# Altium project Handheld.PrjPcb (part 1 of 2)
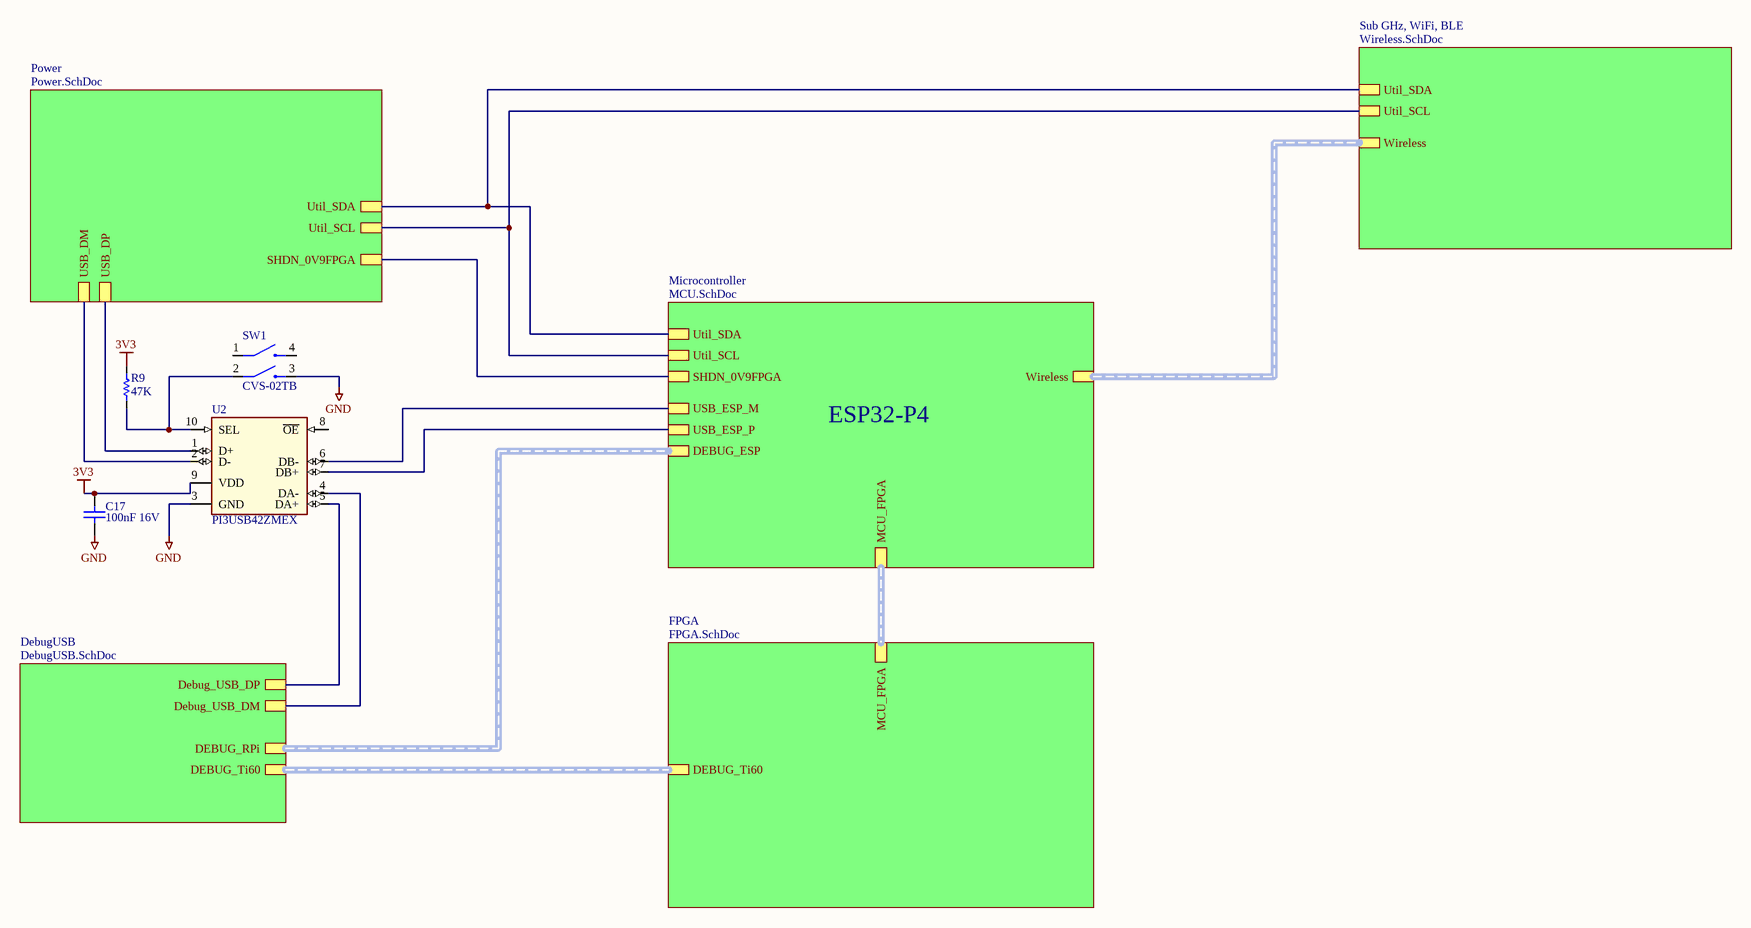
[diagram p0: Main.SchDoc]
CAGE_CODE: ?????; CONTRACT_NUMBER: <CONTRACT NO>; DOC_NO_ASSY_DWG: <ASSY DWG NO>; DOC_NO_BOM: <BOM DOC NO>; DOC_NO_FAB_DWG: <FAB DWG NO>; DOC_NO_SCH_DWG: <SCH DWG NO>; PCB_2_DEC_TOL: +/-.01; PCB_3_DEC_TOL: +/-.010; PCB_ANG_TOL: +/-1/2; PCB_ASSEMBLY_NO: <PCB ASSY NO>; PCB_CHECKER: - -----; PCB_CHECKER_APP_DATE: --/--/----; PCB_DESIGNER: - -----; PCB_DESIGNER_APP_DATE: --/--/----; PCB_DWG_NO: <PCB DWG NO>; PCB_ENGINEER: - -----; PCB_ENGINEER_APP_DATE: --/--/----; PCB_PART_NUMBER: <PCB PN>; PCB_REV: A; SCH_REV: A
10 sheets, 262 parts. Net scope: hierarchical (ports join the sheet entries above them; power ports are global).
Board file: Handheld_REV1.PcbDoc
Sheets:
  Main.SchDoc
    Microcontroller = MCU.SchDoc
      MMI = MMI.SchDoc
    FPGA = FPGA.SchDoc
    Power = Power.SchDoc
    DebugUSB = DebugUSB.SchDoc
    Sub GHz, WiFi, BLE = Wireless.SchDoc
      WiFi = CC3351.SchDoc
      Sub GHz and LoRa = LR2021.SchDoc
      NFC = ST25R.SchDoc

## Sheet Main.SchDoc
size A3; SheetNumber: 1; SheetTotal: 10; ENG_APP_DATE: --/--/--; DSN_APP_DATE: --/--/--; CHK_APP_DATE: --/--/--

### Parts
C17  100nF 16V  [0402]
R9  47K  [0603 Resistor]
SW1  CVS-02TB  [CVS-02TB-Footprint-1]
U2  PI3USB42ZMEX  [QFN40P140X180X60-10N]

### Sub-sheets
DebugUSB = DebugUSB.SchDoc: DEBUG_Ti60 (harness DEBUG_Ti60), DEBUG_RPi (harness DEBUG_RPi), Debug_USB_DM, Debug_USB_DP
FPGA = FPGA.SchDoc: DEBUG_Ti60, MCU_FPGA
Microcontroller = MCU.SchDoc: Util_SDA, Util_SCL, DEBUG_ESP (harness DEBUG_P4), Wireless (harness Wireless), USB_ESP_M, USB_ESP_P, MCU_FPGA (harness MCU_FPGA), SHDN_0V9FPGA
Power = Power.SchDoc: Util_SDA, Util_SCL, USB_DP, USB_DM, SHDN_0V9FPGA
Sub GHz, WiFi, BLE = Wireless.SchDoc: Wireless (harness Wireless), Util_SDA, Util_SCL

### Nets
3V3: C17.2 R9.1 U2.9(VDD)
GND: C17.1 SW1.3 U2.3(GND)
Debug_USB_DM: U2.4(DA-) ; sheet DebugUSB/Debug_USB_DM
Debug_USB_DP: U2.5(DA+) ; sheet DebugUSB/Debug_USB_DP
SHDN_0V9FPGA: sheet Microcontroller/SHDN_0V9FPGA, sheet Power/SHDN_0V9FPGA
USB_DM: U2.2(D-) ; sheet Power/USB_DM
USB_DP: U2.1(D+) ; sheet Power/USB_DP
USB_ESP_M: U2.6(DB-) ; sheet Microcontroller/USB_ESP_M
USB_ESP_P: U2.7(DB+) ; sheet Microcontroller/USB_ESP_P
Util_SCL: sheet Microcontroller/Util_SCL, sheet Power/Util_SCL, sheet Sub GHz, WiFi, BLE/Util_SCL
Util_SDA: sheet Microcontroller/Util_SDA, sheet Power/Util_SDA, sheet Sub GHz, WiFi, BLE/Util_SDA
NetR9_2: R9.2 SW1.2 U2.10(SEL)

Not connected (* = marked no-connect by the designer): SW1 1 4; U2 8(~{OE})

### Buses and harness runs
harness sheet DebugUSB/DEBUG_RPi = sheet Microcontroller/DEBUG_ESP
harness sheet DebugUSB/DEBUG_Ti60 = sheet FPGA/DEBUG_Ti60
harness sheet FPGA/MCU_FPGA = sheet Microcontroller/MCU_FPGA
harness sheet Microcontroller/Wireless = sheet Sub GHz, WiFi, BLE/Wireless

### Notes on the sheet
- ESP32-P4
- Project:
- Title:
- Sheet number:
- Revision:
- Designer:
- out of
- Date:

### Library data of the parts
C17 = CMP-00017-A.2
R9 = CMP-001-B87-6: 47K, 1%, 1/10W, 0603
SW1 = CMP-001-L08-A.1: SWITCH SLIDE DIP SPST 100MA 6V; Pitch: 0.039inch; Electrical Life: 1000Cycles; Body Material: Polyphenylene; Actuator Type: Slide (Standard); Number of Positions: 2; Washable: No; Min Operating Temperature: -40°C; Max Operating Temperature: 85°C; Current Rating: 100mA; Length: 0.118inch; Termination: Gull Wing; Contact Plating: Gold; Voltage Rating (DC): 6V; Mount: Surface Mount; Contact Material: Stainless Steel; Throw Configuration: SPST; Packaging: Tape and Reel
U2 = PI3USB42ZMEX: USB Switch IC 1 Channel 10-UQFN (1.8x1.4); MF: Diodes Inc.; MP: PI3USB42ZMEX; Value: *; Availability: Unavailable; Package: UQFN-10 Diodes Inc.; SnapEDA_Link: https://www.snapeda.com/parts/PI3USB42ZMEX/Diodes%20Inc./view-part/1218281/?ref=snap; Price: None

## Sheet MCU.SchDoc
size A3; SheetNumber: 2; SheetTotal: 10
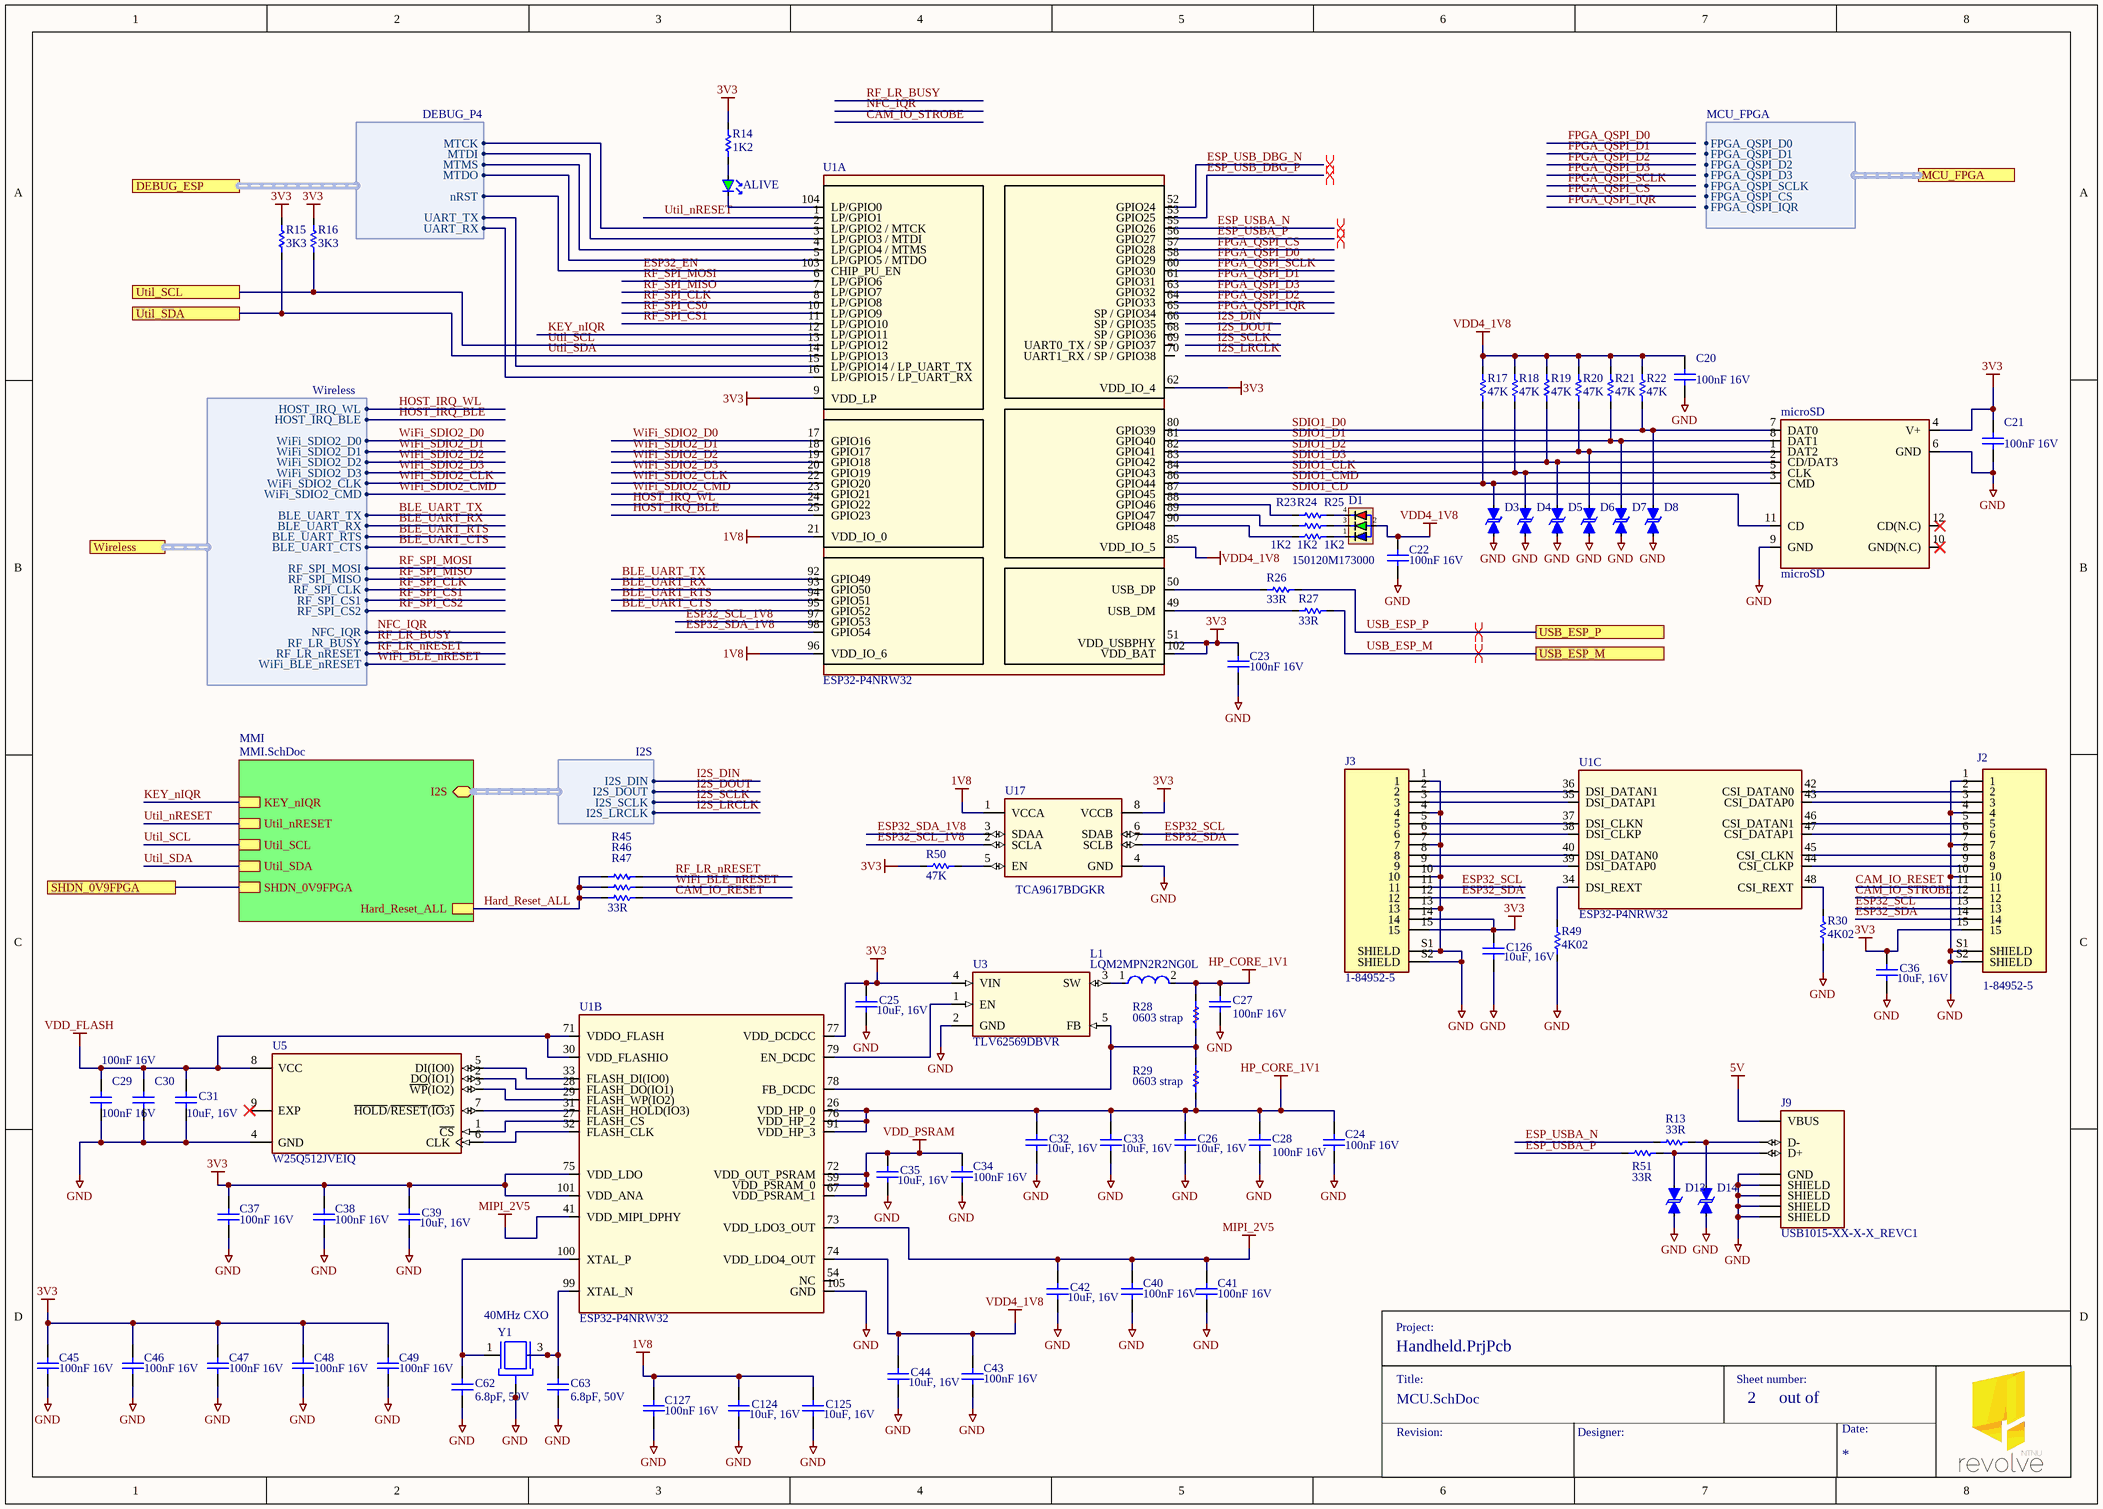
[diagram p1: MCU.SchDoc]

### Parts
ALIVE  SMD LED 0603, Green  [LED-0603-RED]  (value not drawn)
C20  100nF 16V  [0402]
C21  100nF 16V  [0402]
C22  100nF 16V  [0402]
C23  100nF 16V  [0402]
C24  100nF 16V  [0402]
C25  10uF, 16V  [0603 Capacitor]
C26  10uF, 16V  [0603 Capacitor]
C27  100nF 16V  [0402]
C28  100nF 16V  [0402]
C29  100nF 16V  [0402]
C30  100nF 16V  [0402]
C31  10uF, 16V  [0603 Capacitor]
C32  10uF, 16V  [0603 Capacitor]
C33  10uF, 16V  [0603 Capacitor]
C34  100nF 16V  [0402]
C35  10uF, 16V  [0603 Capacitor]
C36  10uF, 16V  [0603 Capacitor]
C37  100nF 16V  [0402]
C38  100nF 16V  [0402]
C39  10uF, 16V  [0603 Capacitor]
C40  100nF 16V  [0402]
C41  100nF 16V  [0402]
C42  10uF, 16V  [0603 Capacitor]
C43  100nF 16V  [0402]
C44  10uF, 16V  [0603 Capacitor]
C45  100nF 16V  [0402]
C46  100nF 16V  [0402]
C47  100nF 16V  [0402]
C48  100nF 16V  [0402]
C49  100nF 16V  [0402]
C62  6.8pF, 50V  [0402 resistor]
C63  6.8pF, 50V  [0402 resistor]
C124  10uF, 16V  [0603 Capacitor]
C125  10uF, 16V  [0603 Capacitor]
C126  10uF, 16V  [0603 Capacitor]
C127  100nF 16V  [0402]
D1  150120M173000  [WL-SFCW_1206]
D3  DESD3V3E1BL-7B  [CR_X1-DFN1006-2_DIO-M]  (value not drawn)
D4  DESD3V3E1BL-7B  [CR_X1-DFN1006-2_DIO-M]  (value not drawn)
D5  DESD3V3E1BL-7B  [CR_X1-DFN1006-2_DIO-M]  (value not drawn)
D6  DESD3V3E1BL-7B  [CR_X1-DFN1006-2_DIO-M]  (value not drawn)
D7  DESD3V3E1BL-7B  [CR_X1-DFN1006-2_DIO-M]  (value not drawn)
D8  DESD3V3E1BL-7B  [CR_X1-DFN1006-2_DIO-M]  (value not drawn)
D13  DESD3V3E1BL-7B  [CR_X1-DFN1006-2_DIO-M]  (value not drawn)
D14  DESD3V3E1BL-7B  [CR_X1-DFN1006-2_DIO-M]  (value not drawn)
J2  1-84952-5  [TE_1-84952-5]
J3  1-84952-5  [TE_1-84952-5]
J9  USB1015-XX-X-X_REVC1  [GCT_USB1015-XX-X-X_REVC1]
L1  LQM2MPN2R2NG0L  [FP-LQM2MPN_G0-IPC_B]
microSD  microSD  [microSD]
R13  33R  [0603 Resistor]
R14  1K2  [0603 Resistor]
R15  3K3  [0603 Resistor]
R16  3K3  [0603 Resistor]
R17  47K  [0603 Resistor]
R18  47K  [0603 Resistor]
R19  47K  [0603 Resistor]
R20  47K  [0603 Resistor]
R21  47K  [0603 Resistor]
R22  47K  [0603 Resistor]
R23  1K2  [0603 Resistor]
R24  1K2  [0603 Resistor]
R25  1K2  [0603 Resistor]
R26  33R  [0603 Resistor]
R27  33R  [0603 Resistor]
R28  0603 strap  [0603 pads]
R29  0603 strap  [0603 pads]
R30  4K02  [0603 Resistor]
R45  33R  [0603 Resistor]  (value not drawn)
R46  33R  [0603 Resistor]  (value not drawn)
R47  33R  [0603 Resistor]
R49  4K02  [0603 Resistor]
R50  47K  [0603 Resistor]
R51  33R  [0603 Resistor]
U1  ESP32-P4NRW32  [QFN35P1000X1000X85_HS-105M]  (parts A,B,C of 3)
U3  TLV62569DBVR  [SOT95P280X145-5N]
U5  W25Q512JVEIQ  [SON127P600X800X80-9N]
U17  TCA9617BDGKR  [SOP65P490X110-8N]
Y1  40MHz CXO  [XTAL_ECS-400-10-37B2-CKM-TR]

### Sub-sheets
MMI = MMI.SchDoc: KEY_nIQR, Util_nRESET, Util_SCL, Util_SDA, SHDN_0V9FPGA, Hard_Reset_ALL, I2S (bidir, harness I2S)

### Ports
DEBUG_ESP (harness DEBUG_P4), MCU_FPGA (harness MCU_FPGA), SHDN_0V9FPGA, USB_ESP_M, USB_ESP_P, Util_SCL, Util_SDA, Wireless (harness Wireless)

### Harnesses
DEBUG_P4: MTCK, MTDI, nRST, UART_TX, UART_RX, MTMS, MTDO
Wireless: WiFi_SDIO2_D0, WiFi_SDIO2_D1, WiFi_SDIO2_D2, WiFi_SDIO2_D3, WiFi_SDIO2_CLK, WiFi_SDIO2_CMD, BLE_UART_TX, BLE_UART_RX, RF_SPI_MOSI, RF_SPI_CLK, RF_SPI_MISO, RF_SPI_CS1, RF_SPI_CS2, BLE_UART_RTS, BLE_UART_CTS, HOST_IRQ_WL, HOST_IRQ_BLE, NFC_IQR, RF_LR_BUSY, RF_LR_nRESET, WiFi_BLE_nRESET
MCU_FPGA: FPGA_QSPI_D0, FPGA_QSPI_D1, FPGA_QSPI_D2, FPGA_QSPI_D3, FPGA_QSPI_SCLK, FPGA_QSPI_CS, FPGA_QSPI_IQR
I2S: I2S_DIN, I2S_DOUT, I2S_SCLK, I2S_LRCLK

### Nets
1V8: C124.2 C125.2 C127.2 U1.21(VDD_IO_0) U1.96(VDD_IO_6) U17.1(VCCA)
3V3: C21.2 C23.2 C25.2 C36.2 C37.2 C38.2 C39.2 C45.2 C46.2 C47.2 C48.2 C49.2 C126.2 J2.15 J3.14 J3.15 microSD.4(V+) R14.2 R15.2 R16.2 R50.1 U1.9(VDD_LP) U1.51(VDD_USBPHY) U1.62(VDD_IO_4) U1.75(VDD_LDO) U1.77(VDD_DCDCC) U1.101(VDD_ANA) U1.102(VDD_BAT) U3.4(VIN) U17.8(VCCB)
5V: J9.1(VBUS)
GND: C20.1 C21.1 C22.1 C23.1 C24.1 C25.1 C26.1 C27.2 C28.2 C29.1 C30.1 C31.1 C32.1 C33.1 C34.1 C35.1 C36.1 C37.1 C38.1 C39.1 C40.1 C41.1 C42.1 C43.1 C44.1 C45.1 C46.1 C47.1 C48.1 C49.1 C62.1 C63.1 C124.1 C125.1 C126.1 C127.1 D3.2(ANODE) D4.2(ANODE) D5.2(ANODE) D6.2(ANODE) D7.2(ANODE) D8.2(ANODE) D13.2(ANODE) D14.2(ANODE) J2.1 J2.4 J2.7 J2.10 J2.S1(SHIELD) J2.S2(SHIELD) J3.1 J3.4 J3.7 J3.10 J3.13 J3.S1(SHIELD) J3.S2(SHIELD) J9.4(GND) J9.SH1(SHIELD) J9.SH2(SHIELD) J9.SH3(SHIELD) J9.SH4(SHIELD) microSD.6(GND) microSD.9(GND) R30.1 R49.1 U1.105(GND) U3.2(GND) U5.4(GND) U17.4(GND) Y1.2(GND) Y1.4(GND)
HP_CORE_1V1: C24.2 C26.2 C27.1 C28.1 C32.2 C33.2 L1.2 R28.2 R29.1 U1.26(VDD_HP_0) U1.76(VDD_HP_2) U1.91(VDD_HP_3)
MIPI_2V5: C40.2 C41.2 C42.2 U1.41(VDD_MIPI_DPHY) U1.73(VDD_LDO3_OUT)
VDD4_1V8: C20.2 C22.2 C43.2 C44.2 D1.2(Anode) R17.1 R18.1 R19.1 R20.1 R21.1 R22.1 U1.74(VDD_LDO4_OUT) U1.85(VDD_IO_5)
VDD_FLASH: C29.2 C30.2 C31.2 U1.30(VDD_FLASHIO) U1.71(VDDO_FLASH) U5.8(VCC)
VDD_PSRAM: C34.2 C35.2 U1.59(VDD_PSRAM_0) U1.67(VDD_PSRAM_1) U1.72(VDD_OUT_PSRAM)
BLE_UART_CTS: U1.95(GPIO52) ; port Wireless.BLE_UART_CTS
BLE_UART_RTS: U1.94(GPIO51) ; port Wireless.BLE_UART_RTS
BLE_UART_RX: U1.93(GPIO50) ; port Wireless.BLE_UART_RX
BLE_UART_TX: U1.92(GPIO49) ; port Wireless.BLE_UART_TX
CAM_IO_RESET: J2.11 R47.2
CAM_IO_STROBE: J2.12
ESP32_EN: U1.103(CHIP_PU_EN) ; port DEBUG_ESP.nRST
ESP32_SCL: J2.13 J3.11 U17.6(SDAB)
ESP32_SCL_1V8: U1.97(GPIO53) U17.2(SCLA)
ESP32_SDA: J2.14 J3.12 U17.7(SCLB)
ESP32_SDA_1V8: U1.98(GPIO54) U17.3(SDAA)
ESP_USB_DBG_N: U1.52(GPIO24)
ESP_USB_DBG_P: U1.53(GPIO25)
ESP_USBA_N: R13.1 U1.55(GPIO26)
ESP_USBA_P: R51.1 U1.56(GPIO27)
FPGA_QSPI_CS: U1.57(GPIO28)
FPGA_QSPI_D0: U1.58(GPIO29)
FPGA_QSPI_D1: U1.61(GPIO31)
FPGA_QSPI_D2: U1.64(GPIO33)
FPGA_QSPI_D3: U1.63(GPIO32)
FPGA_QSPI_IQR: U1.65(SP_/_GPIO34)
FPGA_QSPI_SCLK: U1.60(GPIO30)
Hard_Reset_ALL: R45.1 R46.1 R47.1 ; sheet MMI/Hard_Reset_ALL
HOST_IRQ_BLE: U1.25(GPIO23) ; port Wireless.HOST_IRQ_BLE
HOST_IRQ_WL: U1.24(GPIO22) ; port Wireless.HOST_IRQ_WL
KEY_nIQR: U1.12(LP/GPIO11) ; sheet MMI/KEY_nIQR
MTCK: U1.2(LP/GPIO2_/_MTCK) ; port DEBUG_ESP.MTCK
MTDI: U1.3(LP/GPIO3_/_MTDI) ; port DEBUG_ESP.MTDI
MTDO: U1.5(LP/GPIO5_/_MTDO) ; port DEBUG_ESP.MTDO
MTMS: U1.4(LP/GPIO4_/_MTMS) ; port DEBUG_ESP.MTMS
RF_LR_nRESET: R45.2 ; port Wireless.RF_LR_nRESET
RF_SPI_CLK: U1.8(LP/GPIO8) ; port Wireless.RF_SPI_CLK
RF_SPI_CS0: U1.10(LP/GPIO9)
RF_SPI_CS1: U1.11(LP/GPIO10) ; port Wireless.RF_SPI_CS1
RF_SPI_MISO: U1.7(LP/GPIO7) ; port Wireless.RF_SPI_MISO
RF_SPI_MOSI: U1.6(LP/GPIO6) ; port Wireless.RF_SPI_MOSI
SDIO1_CD: microSD.11(CD) U1.87(GPIO45)
SDIO1_CLK: D4.1(CATHODE) microSD.5(CLK) R18.2 U1.84(GPIO43)
SDIO1_CMD: D3.1(CATHODE) microSD.3(CMD) R17.2 U1.86(GPIO44)
SDIO1_D0: D8.1(CATHODE) microSD.7(DAT0) R22.2 U1.80(GPIO39)
SDIO1_D1: D7.1(CATHODE) microSD.8(DAT1) R21.2 U1.81(GPIO40)
SDIO1_D2: D6.1(CATHODE) microSD.1(DAT2) R20.2 U1.82(GPIO41)
SDIO1_D3: D5.1(CATHODE) microSD.2(CD/DAT3) R19.2 U1.83(GPIO42)
SHDN_0V9FPGA: port SHDN_0V9FPGA, sheet MMI/SHDN_0V9FPGA
UART_RX_P4: U1.16(LP/GPIO15_/_LP_UART_RX) ; port DEBUG_ESP.UART_RX
UART_TX_P4: U1.15(LP/GPIO14_/_LP_UART_TX) ; port DEBUG_ESP.UART_TX
USB_ESP_M: R27.2 ; port USB_ESP_M
USB_ESP_P: R26.2 ; port USB_ESP_P
Util_nRESET: U1.1(LP/GPIO1) ; sheet MMI/Util_nRESET
Util_SCL: R16.1 U1.13(LP/GPIO12) ; port Util_SCL, sheet MMI/Util_SCL
Util_SDA: R15.1 U1.14(LP/GPIO13) ; port Util_SDA, sheet MMI/Util_SDA
WiFi_BLE_nRESET: R46.2 ; port Wireless.WiFi_BLE_nRESET
WiFi_SDIO2_CLK: U1.22(GPIO20) ; port Wireless.WiFi_SDIO2_CLK
WiFi_SDIO2_CMD: U1.23(GPIO21) ; port Wireless.WiFi_SDIO2_CMD
WiFi_SDIO2_D0: U1.17(GPIO16) ; port Wireless.WiFi_SDIO2_D0
WiFi_SDIO2_D1: U1.18(GPIO17) ; port Wireless.WiFi_SDIO2_D1
WiFi_SDIO2_D2: U1.19(GPIO18) ; port Wireless.WiFi_SDIO2_D2
WiFi_SDIO2_D3: U1.20(GPIO19) ; port Wireless.WiFi_SDIO2_D3
NetALIVE_1: ALIVE.1(A) R14.1
NetALIVE_2: ALIVE.2(K) U1.104(LP/GPIO0)
NetC62_2: C62.2 U1.100(XTAL_P) Y1.1(IN/OUT)
NetC63_2: C63.2 U1.99(XTAL_N) Y1.3(OUT/IN)
NetD1_1: D1.1 R25.2
NetD1_3: D1.3 R24.2
NetD1_4: D1.4 R23.2
NetD13_1: D13.1(CATHODE) J9.3(D+) R51.2
NetD14_1: D14.1(CATHODE) J9.2(D-) R13.2
NetJ2_2: J2.2 U1.42(CSI_DATAN0)
NetJ2_3: J2.3 U1.43(CSI_DATAP0)
NetJ2_5: J2.5 U1.46(CSI_DATAN1)
NetJ2_6: J2.6 U1.47(CSI_DATAP1)
NetJ2_8: J2.8 U1.45(CSI_CLKN)
NetJ2_9: J2.9 U1.44(CSI_CLKP)
NetJ3_2: J3.2 U1.36(DSI_DATAN1)
NetJ3_3: J3.3 U1.35(DSI_DATAP1)
NetJ3_5: J3.5 U1.37(DSI_CLKN)
NetJ3_6: J3.6 U1.38(DSI_CLKP)
NetJ3_8: J3.8 U1.40(DSI_DATAN0)
NetJ3_9: J3.9 U1.39(DSI_DATAP0)
NetL1_1: L1.1 U3.3(SW)
NetR23_1: R23.1 U1.88(GPIO46)
NetR24_1: R24.1 U1.89(GPIO47)
NetR25_1: R25.1 U1.90(GPIO48)
NetR26_1: R26.1 U1.50(USB_DP)
NetR27_1: R27.1 U1.49(USB_DM)
NetR28_1: R28.1 R29.2 U1.78(FB_DCDC) U3.5(FB)
NetR30_2: R30.2 U1.48(CSI_REXT)
NetR49_2: R49.2 U1.34(DSI_REXT)
NetR50_2: R50.2 U17.5(EN)
NetU1_27: U1.27(FLASH_CS) U5.1(~{CS})
NetU1_28: U1.28(FLASH_DO(IO1)) U5.2(DO(IO1))
NetU1_29: U1.29(FLASH_WP(IO2)) U5.3(~{WP}(IO2))
NetU1_31: U1.31(FLASH_HOLD(IO3)) U5.7(~{HOLD}/~{RESET}(~{IO}3~{)})
NetU1_32: U1.32(FLASH_CLK) U5.6(CLK)
NetU1_33: U1.33(FLASH_DI(IO0)) U5.5(DI(IO0))
NetU1_79: U1.79(EN_DCDC) U3.1(EN)

Not connected (* = marked no-connect by the designer): microSD 10(GND(N.C))* 12(CD(N.C))*; U1 54(NC) 66(SP_/_GPIO35) 68(SP_/_GPIO36) 69(UART0_TX_/_SP_/_GPIO37) 70(UART1_RX_/_SP_/_GPIO38); U5 9(EXP)*

### Layout directives
differential pair: ESP_USB_DBG_N, ESP_USB_DBG_P, ESP_USBA_N, ESP_USBA_P, USB_ESP_M, USB_ESP_P

### Notes on the sheet
- Project:
- Title:
- Sheet number:
- Revision:
- Designer:
- out of
- Date:

### Library data of the parts
ALIVE = CMP-004-00003-1: 0603LED-Green; Component Type: Standard; Design Item ID: CMP-001-C10-9; Source: Components - 10.10.25 - 00.17.SchLib; Pin Count: 2
C20-C24 C27-C30 C34 C37 C38 C40 C41 C43 C45-C49 C127 = CMP-00017-A.2
C25 C26 C31-C33 C35 C36 C39 C42 C44 C124-C126 = CMP-001-B36-7: 10uF, 16V, 20%, X5R, 0603; value: 10uF
C62 C63 = CMP-00397-1: 6.8pF, 50V, 10%, 0402; Voltage Rating (DC): 50V; Value: 6.8pF
D1 = CMP-004-00000-1: Led, Red/Green/Blue, 360Mcd/1Cd/350Mcd Rohs Compliant: Yes; Max Reverse Voltage (DC): 5V; Viewing Angle: 120°; Forward Current: 100mA; Luminous Intensity: 350mcd; Dominant Wavelength: 525nm; Forward Voltage: 2V; Power Dissipation: 65mW; Peak Wavelength: 468nm; Max Operating Temperature: 85°C; Width: 1.6mm; Length: 3.2mm; Height: 700µm; RoHS: Compliant; Min Operating Temperature: -40°C
D3-D8 D13 D14 = DESD3V3E1BL-7B: TVS DIODE 3.3V, DFN1006-2, 13pF @ 1MHz; Manufacturer_Name: Diodes Inc; Copyright: Copyright (C) 2025 Ultra Librarian. All rights reserved.; Manufacturer_Part_Number: DESD3V3E1BL-7B; RefDes: RefDes; Type: Type
J2 J3 = 1-84952-5: Conn FPC Connector SKT 15 POS 1mm Solder RA SMD T/R; MF: TE Connectivity; Value: *; SnapEDA_Link: https://www.snapeda.com/parts/1-84952-5/TE+Connectivity+AMP+Connectors/view-part/?ref=snap; Purchase-URL: https://pricing.snapeda.com/search/part/1-84952-5/?ref=eda; EU_RoHS_Compliance: Compliant; Availability: In Stock; Price: None; Package: None; Check_prices: https://www.snapeda.com/parts/1-84952-5/TE+Connectivity+AMP+Connectors/view-part/?ref=eda; MP: 1-84952-5
J9 = USB1015-XX-X-X_REVC1: USB-A (USB TYPE-A) USB 2.0 Receptacle Connector 4 Position Board Edge, Cutout; Through Hole, Right Angle; MF: Global Connector Technology; MP: USB1015-GF-L-A; SnapEDA_Link: https://www.snapeda.com/parts/USB1015-GF-L-A/Global+Connector+Technology/view-part/?ref=snap; Package: None; Value: *; Check_prices: https://www.snapeda.com/parts/USB1015-GF-L-A/Global+Connector+Technology/view-part/?ref=eda
L1 = CMP-006-00001-1: Inductor Power Chip Shielded Multi-Layer 2.2uH 30% 1MHz Ferrite 1.2A 0.138Ohm DCR 0806 T/R; Manufacturer Lifecycle Status: IN PRODUCTION; Value: 138mΩ; Shielding: Yes; Self Resonant Frequency: 40MHz; Number of Circuits: 1; Depth: 1.75mm; Max Operating Temperature: 125°C; DC Current: 1.2A; Schedule B: 8504500000, 8504500000; Test Frequency: 1MHz; Current Rating: 1.2A; Case Code (Imperial): 0806; Packaging: Cut Tape; Military Standard: Not; Height: 900µm; Max Current Rating: 1.2A; Lead Free: Lead Free; Tolerance: 30%; REACH SVHC: Yes; Min Operating Temperature: -55°C; Radiation Hardening: No; Number of Terminals: 2; ESR: 138mΩ; Width: 1.6mm; Inductance Tolerance: 30%; Lifecycle Status: Production; Height - Seated (Max): 990.6µm; Case Code (Metric): 2016; Case/Package: 0806; Max DC Current: 1.2A; Core Material: Ferrite; Termination: SMD/SMT; RoHS: Compliant; Mounting Technology: Surface Mount; RMS Current (Irms): 1.2A; DC Resistance (DCR): 138mΩ; Length: 2.0066mm
microSD = microSD: wurth µSD connector
R13 R26 R27 R45-R47 R51 = CMP-001-C30-7: 33R, 1%, 1/10W, 0603; Manufacturer: Panasonic; Manufacturer Part Number: ERJ-3EKF33R0V; Temperature Coefficient: 100ppm/°C; Max Power Dissipation: 100mW; Voltage Rating: 75V; REACH SVHC: No SVHC; Resistance: 33R; Composition: Thick Film; Tolerance: 1%; Lead Free: Lead Free; Contact Plating: Tin; Package Quantity: 1; Number of Terminations: 2; Number of Pins: 2; Case Code (Metric): 1608; Width: 0.031inch; Min Operating Temperature: -55°C; Military Standard: Not; Termination: SMD/SMT; Radiation Hardening: No; Case Code (Imperial): 0603; Mount: Surface Mount; Depth: 0.8mm; Max Operating Temperature: 155°C; Voltage Rating (DC): 75V; Features: Automotive AEC-Q200; Power Rating: 100mW; Packaging: Tape and Reel; Supplier Part Number: P33.0HCT-ND; Length: 1.6mm; Supplier: Digi-Key; Height: 0.022inch; Case/Package: 0603
R14 R23-R25 = CMP-001-B03-6: 1K2, 5%, 1/10W, 0603
R15 R16 = CMP-001-G92-A.2: 3K3, 5%, 1/10W, 0603
R17-R22 R50 = CMP-001-B87-6: 47K, 1%, 1/10W, 0603
R28 R29 = CMP-001-E44-4: No resistor, just the pad
R30 R49 = CMP-001-R11-1: 4K02, 1%, 1/10W, 0603
U1 = ESP32-P4NRW32-R09.0.1: RISC-V 32-bit dual-core 360MHz,  32MB PSRAM, 55xGPIO
U3 = TLV62569DBVR: 2.5V-5.5V input, 2-A high efficiency step-down buck converter in SOT23 and SOT563 package; MF: Texas Instruments; SnapEDA_Link: https://www.snapeda.com/parts/TLV62569DBVR/Texas+Instruments/view-part/?ref=snap; Package: SOT-23-5 Texas Instruments; Value: *; MP: TLV62569DBVR; Check_prices: https://www.snapeda.com/parts/TLV62569DBVR/Texas+Instruments/view-part/?ref=eda; Supplier 1: DigiKey; Supplier Part Number 1: 296-47360-1-ND; Supplier 2: Mouser; Supplier Part Number 2: 445-SY20018IAAC
U5 = W25Q512JVEIQ: FLASH - NOR Memory IC 512Mb (64M x 8) SPI - Quad I/O 133 MHz 8-WSON (8x6); MF: Winbond Electronics; SnapEDA_Link: https://www.snapeda.com/parts/W25Q512JVEIQ/Winbond/view-part/?ref=snap; Package: Package; Value: *; MP: W25Q512JVEIQ; Check_prices: https://www.snapeda.com/parts/W25Q512JVEIQ/Winbond/view-part/?ref=eda; Supplier 1: DigiKey; Supplier Part Number 1: 256-W25Q512JVEIQ-TUBE-ND
U17 = TCA9617BDGKR: 2-bit level-translating 1-MHz I2C/SMBus buffer/repeater with powered-off high-impedance; MF: Texas Instruments; SnapEDA_Link: https://www.snapeda.com/parts/TCA9617BDGKR/Texas+Instruments/view-part/?ref=snap; Package: VSSOP-8 Texas Instruments; Value: *; MP: TCA9617BDGKR; Check_prices: https://www.snapeda.com/parts/TCA9617BDGKR/Texas+Instruments/view-part/?ref=eda; Supplier 1: Arrow Electronics; Supplier Part Number 1: TCA9617BDGKR
Y1 = ECS-400-10-37B2-CKM-TR: Crystal 40MHz ±10ppm (Tol) ±10ppm (Stability) 10pF FUND 40Ohm 4-Pin Mini-CSMD T/R; MF: ECS Inc.; SnapEDA_Link: https://www.snapeda.com/parts/ECS-400-10-37B2-CKM-TR/ECS+Inc./view-part/?ref=snap; Package: ECX-1637B-37B-4 ECS; Value: *; MP: ECS-400-10-37B2-CKM-TR; Check_prices: https://www.snapeda.com/parts/ECS-400-10-37B2-CKM-TR/ECS+Inc./view-part/?ref=eda

## Sheet MMI.SchDoc
size 292 x 193 mm; SheetNumber: 3; SheetTotal: 10
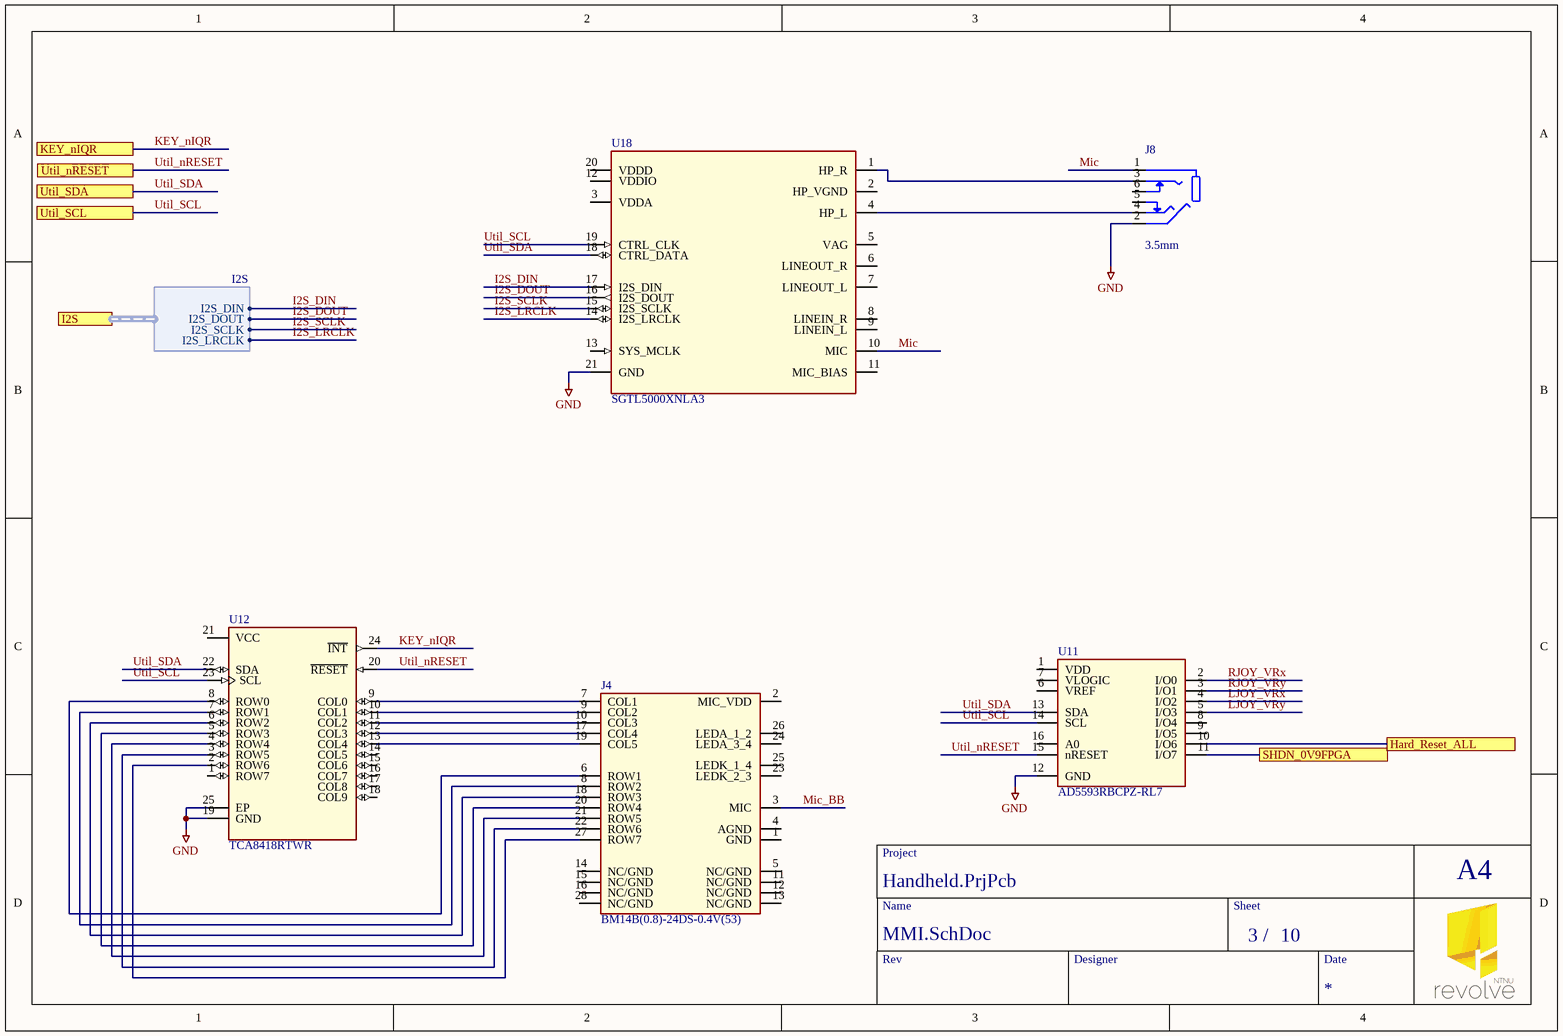
[diagram p2: MMI.SchDoc]

### Parts
J4  BM14B(0.8)-24DS-0.4V(53)  [CONN24_BM14B_HIR]
J8  3.5mm  [TENSILITY_54-00176]
U11  AD5593RBCPZ-RL7  [CP_16_32_ADI-M]
U12  TCA8418RTWR  [QFN50P400X400X80-25N]
U18  SGTL5000XNLA3  [HUQFN20_SOT1628-1_NXP-M]

### Ports
Hard_Reset_ALL, I2S (harness I2S), KEY_nIQR, SHDN_0V9FPGA, Util_nRESET, Util_SCL, Util_SDA

### Harnesses
I2S: I2S_DIN, I2S_DOUT, I2S_SCLK, I2S_LRCLK

### Nets
GND: J8.2 U11.12(GND) U12.19(GND) U12.25(EP) U18.21(GND)
Hard_Reset_ALL: U11.10(I/O6) ; port Hard_Reset_ALL
I2S_DIN: U18.17(I2S_DIN) ; port I2S.I2S_DIN
I2S_DOUT: U18.16(I2S_DOUT) ; port I2S.I2S_DOUT
I2S_LRCLK: U18.14(I2S_LRCLK) ; port I2S.I2S_LRCLK
I2S_SCLK: U18.15(I2S_SCLK) ; port I2S.I2S_SCLK
KEY_nIQR: U12.24(~{INT}) ; port KEY_nIQR
LJOY_VRx: U11.4(I/O2)
LJOY_VRy: U11.5(I/O3)
Mic: J8.1 U18.10(MIC)
Mic_BB: J4.3(MIC)
RJOY_VRx: U11.2(I/O0)
RJOY_VRy: U11.3(I/O1)
SHDN_0V9FPGA: U11.11(I/O7) ; port SHDN_0V9FPGA
Util_nRESET: U11.15(nRESET) U12.20(~{RESET}) ; port Util_nRESET
Util_SCL: U11.14(SCL) U12.23(SCL) U18.19(CTRL_CLK) ; port Util_SCL
Util_SDA: U11.13(SDA) U12.22(SDA) U18.18(CTRL_DATA) ; port Util_SDA
NetJ4_6: J4.6(ROW1) U12.8(ROW0)
NetJ4_7: J4.7(COL1) U12.9(COL0)
NetJ4_8: J4.8(ROW2) U12.7(ROW1)
NetJ4_9: J4.9(COL2) U12.10(COL1)
NetJ4_10: J4.10(COL3) U12.11(COL2)
NetJ4_17: J4.17(COL4) U12.12(COL3)
NetJ4_18: J4.18(ROW3) U12.6(ROW2)
NetJ4_19: J4.19(COL5) U12.13(COL4)
NetJ4_20: J4.20(ROW4) U12.5(ROW3)
NetJ4_21: J4.21(ROW5) U12.4(ROW4)
NetJ4_22: J4.22(ROW6) U12.3(ROW5)
NetJ4_27: J4.27(ROW7) U12.2(ROW6)
NetJ8_3: J8.3 U18.1(HP_R)
NetJ8_4: J8.4 U18.4(HP_L)

Not connected (* = marked no-connect by the designer): J4 1(GND) 2(MIC_VDD) 4(AGND) 5(NC/GND) 11(NC/GND) 12(NC/GND) 13(NC/GND) 14(NC/GND) 15(NC/GND) 16(NC/GND) 23(LEDK_2_3) 24(LEDA_3_4) 25(LEDK_1_4) 26(LEDA_1_2) 28(NC/GND); J8 5 6; U11 1(VDD) 6(VREF) 7(VLOGIC) 8(I/O4) 9(I/O5) 16(A0); U12 1(ROW7) 14(COL5) 15(COL6) 16(COL7) 17(COL8) 18(COL9) 21(VCC); U18 2(HP_VGND) 3(VDDA) 5(VAG) 6(LINEOUT_R) 7(LINEOUT_L) 8(LINEIN_R) 9(LINEIN_L) 11(MIC_BIAS) 12(VDDIO) 13(SYS_MCLK) 20(VDDD)

### Notes on the sheet
- Project
- Name
- Sheet
- A4
- Rev
- Designer
- /
- Date

### Library data of the parts
J4 = BM14B0.8-24DS-0.4V53: BB Q10 keyboard connector; Manufacturer_Name: Hirose; Type: Arrays, Edge Type, Mezzanine (Board to Board); Copyright: Copyright (C) 2025 Ultra Librarian. All rights reserved.; Manufacturer_Part_Number: BM14B(0.8)-24DS-0.4V(53); RefDes: RefDes; Supplier 1: DigiKey; Supplier Part Number 1: H122178CT-ND
J8 = 54-00176: Connector, 4C audio jack, 3.5xL14 mm, thru hole, gold plated; MF: Tensility International Corp; SnapEDA_Link: https://www.snapeda.com/parts/54-00176/Tensility/view-part/?ref=snap; Package: None; Value: *; MP: 54-00176; Check_prices: https://www.snapeda.com/parts/54-00176/Tensility/view-part/?ref=eda; Supplier 1: Arrow Electronics; Supplier Part Number 1: 54-00176
U11 = AD5593RBCPZ-RL7: 8-Channel, 12-Bit, Configurable ADC/DAC with On-Chip Reference, I2C Interface; Manufacturer_Name: Analog Devices Inc; Copyright: Copyright (C) 2025 Ultra Librarian. All rights reserved.; Manufacturer_Part_Number: AD5593RBCPZ-RL7; Datasheet: https://www.analog.com/media/en/technical-documentation/data-sheets/AD5593R.pdf; RefDes: RefDes; Type: Type
U12 = TCA8418RTWR: I2C Controlled Keypad Scan IC With Integrated ESD Protection 24-WQFN -40 to 85; MF: Texas Instruments; Purchase-URL: https://pricing.snapeda.com/search/part/TCA8418RTWR/?ref=eda; Value: *; SnapEDA_Link: https://www.snapeda.com/parts/TCA8418RTWR/Texas%20Instruments/view-part/229165/?ref=snap; Package: WQFN-24 Texas Instruments; MP: TCA8418RTWR; Digi-Key_Part_Number: 296-25223-1-ND; Check_prices: https://www.snapeda.com/parts/TCA8418RTWR/Texas%20Instruments/view-part/229165/?ref=eda
U18 = SGTL5000XNLA3: IC AUDIO CODEC STEREO 20-QFN; Manufacturer_Name: NXP; Copyright: Copyright (C) 2025 Ultra Librarian. All rights reserved.; Manufacturer_Part_Number: SGTL5000XNLA3; RefDes: RefDes; Type: Type; Supplier 1: Newark; Supplier Part Number 1: SGTL5000XNLA3

## Sheet FPGA.SchDoc
size A3; SheetNumber: 4; SheetTotal: 10
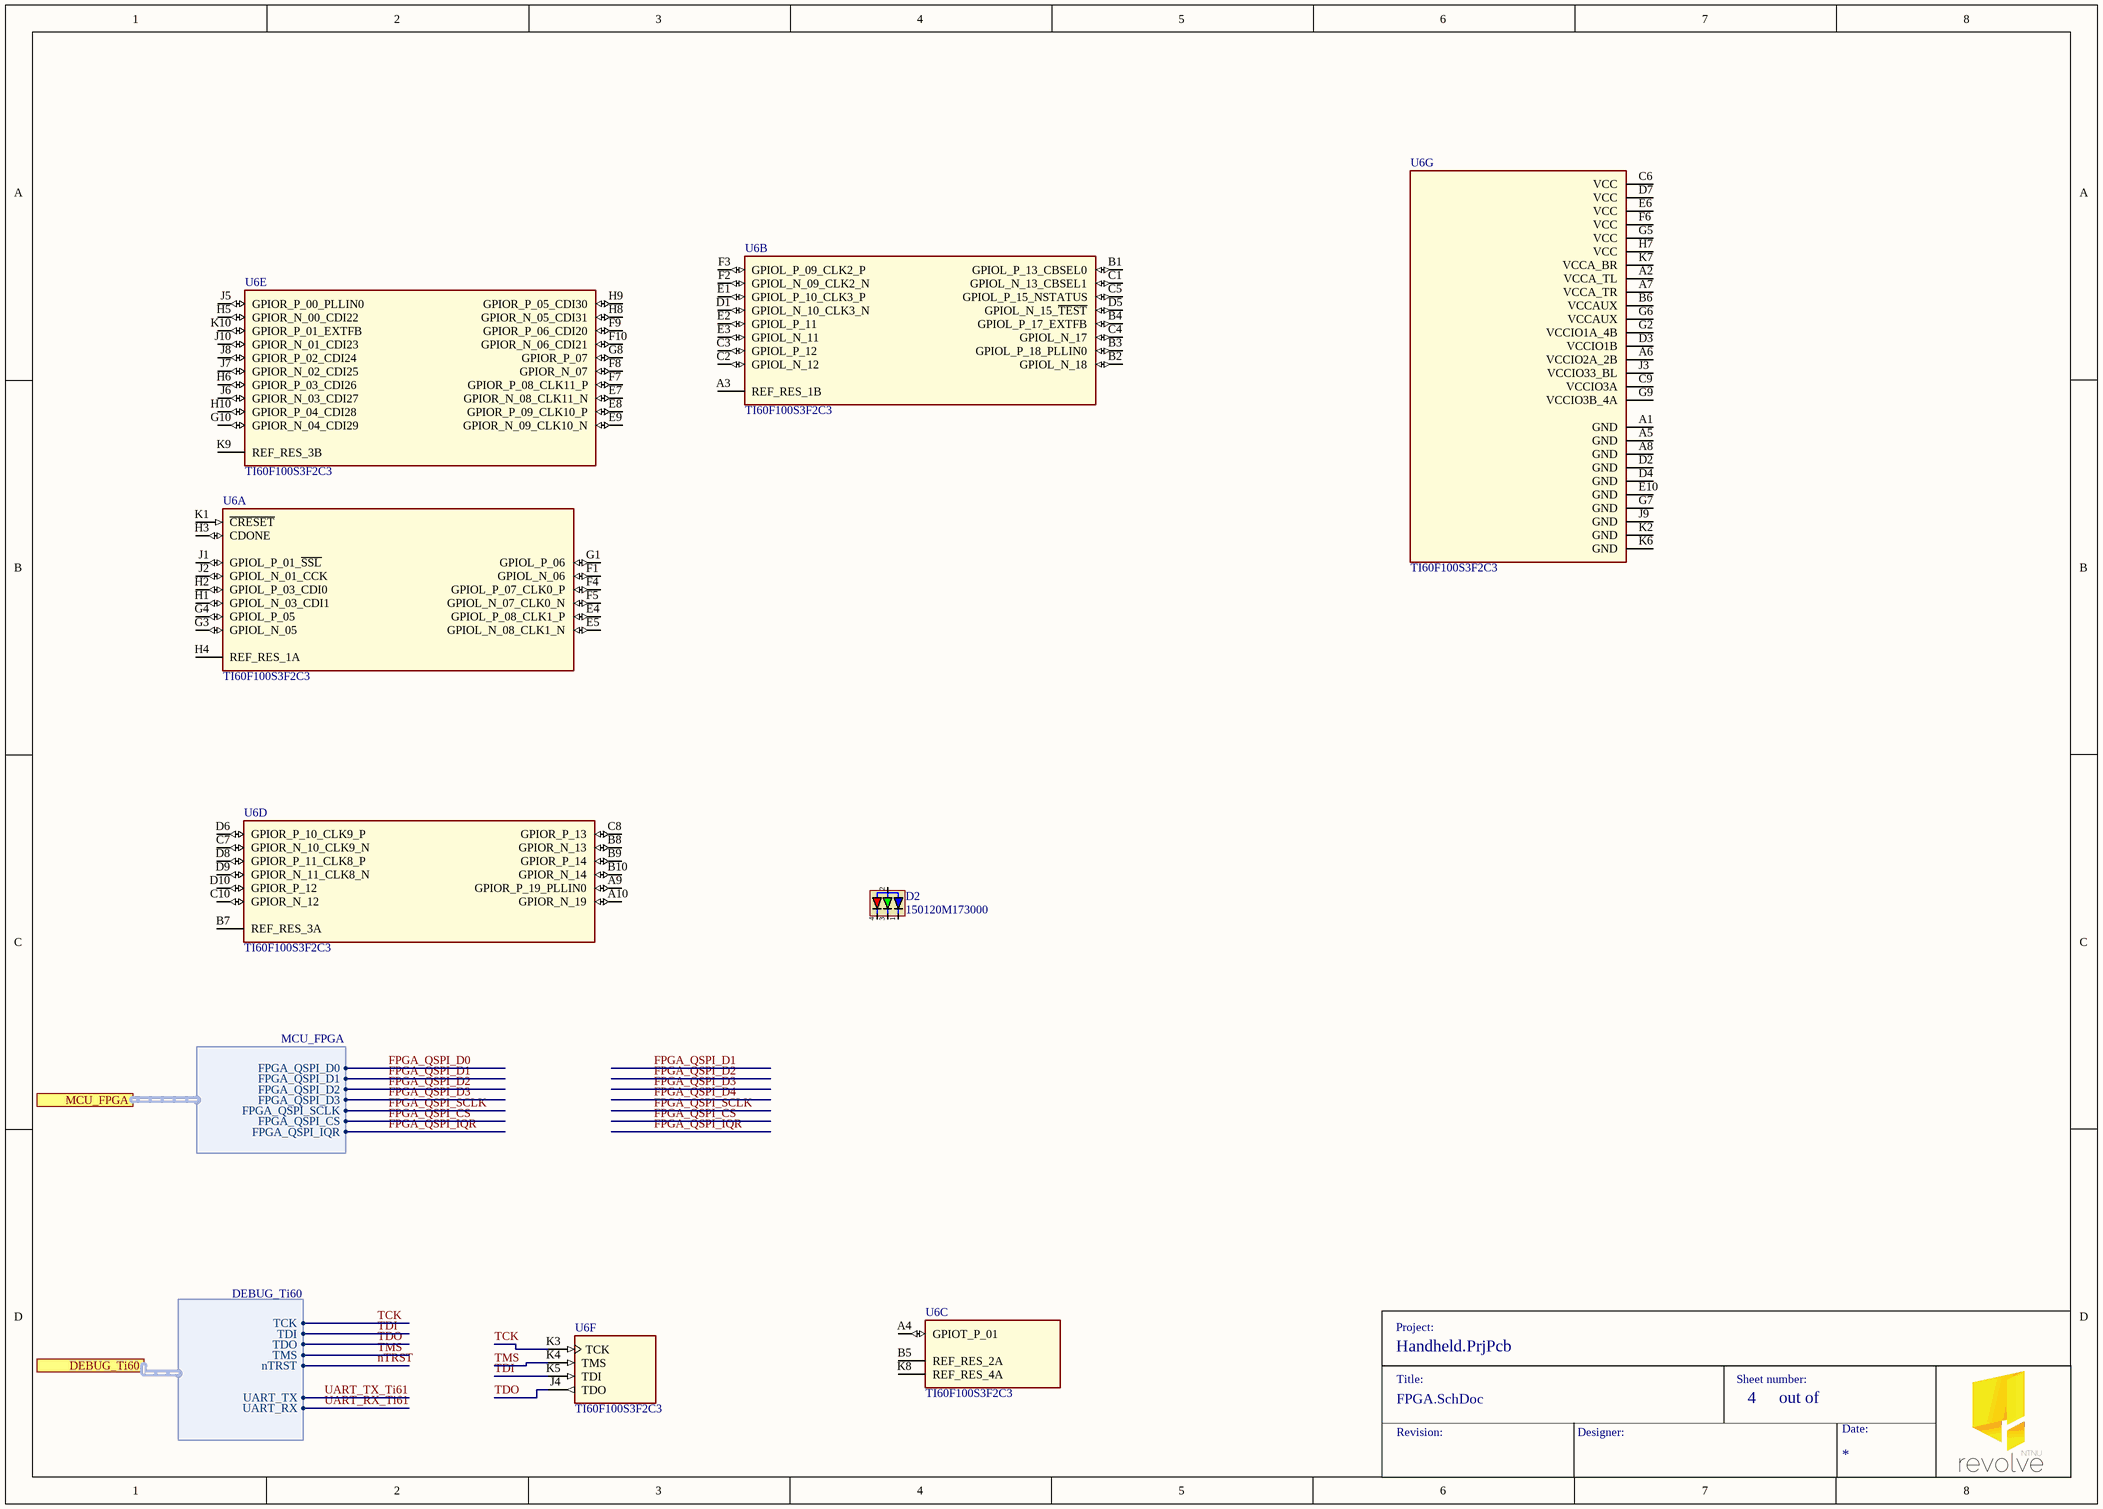
[diagram p3: FPGA.SchDoc]

### Parts
D2  150120M173000  [150120M173000-Footprint-1]
U6  TI60F100S3F2C3  [IC_TI60F100S3F2C3]  (parts A,B,C,D,E,F,G of 7)

### Ports
DEBUG_Ti60 (harness DEBUG_Ti60), MCU_FPGA (harness MCU_FPGA)

### Harnesses
DEBUG_Ti60: TCK, TDI, TDO, TMS, nTRST, UART_TX, UART_RX
MCU_FPGA: FPGA_QSPI_D0, FPGA_QSPI_D1, FPGA_QSPI_D2, FPGA_QSPI_D3, FPGA_QSPI_SCLK, FPGA_QSPI_CS, FPGA_QSPI_IQR

### Nets
FPGA_QSPI_CS: port MCU_FPGA.FPGA_QSPI_CS
FPGA_QSPI_D0: port MCU_FPGA.FPGA_QSPI_D0
FPGA_QSPI_D1: port MCU_FPGA.FPGA_QSPI_D1
FPGA_QSPI_D2: port MCU_FPGA.FPGA_QSPI_D2
FPGA_QSPI_D3: port MCU_FPGA.FPGA_QSPI_D3
FPGA_QSPI_IQR: port MCU_FPGA.FPGA_QSPI_IQR
FPGA_QSPI_SCLK: port MCU_FPGA.FPGA_QSPI_SCLK
TCK: U6.K3(TCK) ; port DEBUG_Ti60.TCK
TDI: U6.K5(TDI) ; port DEBUG_Ti60.TDI
TDO: U6.J4(TDO) ; port DEBUG_Ti60.TDO
TMS: U6.K4(TMS) ; port DEBUG_Ti60.TMS
UART_RX_Ti61: port DEBUG_Ti60.UART_RX
UART_TX_Ti61: port DEBUG_Ti60.UART_TX

Not connected (* = marked no-connect by the designer): D2 1(5) 2(Anode) 3(4) 4(3); U6 A1(GND) A2(VCCA_TL) A3(REF_RES_1B) A4(GPIOT_P_01) A5(GND) A6(VCCIO2A_2B) A7(VCCA_TR) A8(GND) A9(GPIOR_P_19_PLLIN0) A10(GPIOR_N_19) B1(GPIOL_P_13_CBSEL0) B2(GPIOL_N_18) B3(GPIOL_P_18_PLLIN0) B4(GPIOL_P_17_EXTFB) B5(REF_RES_2A) B6(VCCAUX) B7(REF_RES_3A) B8(GPIOR_N_13) B9(GPIOR_P_14) B10(GPIOR_N_14) C1(GPIOL_N_13_CBSEL1) C2(GPIOL_N_12) C3(GPIOL_P_12) C4(GPIOL_N_17) C5(GPIOL_P_15_NSTATUS) C6(VCC) C7(GPIOR_N_10_CLK9_N) C8(GPIOR_P_13) C9(VCCIO3A) C10(GPIOR_N_12) D1(GPIOL_N_10_CLK3_N) D2(GND) D3(VCCIO1B) D4(GND) D5(GPIOL_N_15_~{TEST}) D6(GPIOR_P_10_CLK9_P) D7(VCC) D8(GPIOR_P_11_CLK8_P) D9(GPIOR_N_11_CLK8_N) D10(GPIOR_P_12) E1(GPIOL_P_10_CLK3_P) E2(GPIOL_P_11) E3(GPIOL_N_11) E4(GPIOL_P_08_CLK1_P) E5(GPIOL_N_08_CLK1_N) E6(VCC) E7(GPIOR_N_08_CLK11_N) E8(GPIOR_P_09_CLK10_P) E9(GPIOR_N_09_CLK10_N) E10(GND) F1(GPIOL_N_06) F2(GPIOL_N_09_CLK2_N) F3(GPIOL_P_09_CLK2_P) F4(GPIOL_P_07_CLK0_P) F5(GPIOL_N_07_CLK0_N) F6(VCC) F7(GPIOR_P_08_CLK11_P) F8(GPIOR_N_07) F9(GPIOR_P_06_CDI20) F10(GPIOR_N_06_CDI21) G1(GPIOL_P_06) G2(VCCIO1A_4B) G3(GPIOL_N_05) G4(GPIOL_P_05) G5(VCC) G6(VCCAUX) G7(GND) G8(GPIOR_P_07) G9(VCCIO3B_4A) G10(GPIOR_N_04_CDI29) H1(GPIOL_N_03_CDI1) H2(GPIOL_P_03_CDI0) H3(CDONE) H4(REF_RES_1A) H5(GPIOR_N_00_CDI22) H6(GPIOR_P_03_CDI26) H7(VCC) H8(GPIOR_N_05_CDI31) H9(GPIOR_P_05_CDI30) H10(GPIOR_P_04_CDI28) J1(GPIOL_P_01_~{SSL}) J2(GPIOL_N_01_CCK) J3(VCCIO33_BL) J5(GPIOR_P_00_PLLIN0) J6(GPIOR_N_03_CDI27) J7(GPIOR_N_02_CDI25) J8(GPIOR_P_02_CDI24) J9(GND) J10(GPIOR_N_01_CDI23) K1(~{CRESET}) K2(GND) K6(GND) K7(VCCA_BR) K8(REF_RES_4A) K9(REF_RES_3B) K10(GPIOR_P_01_EXTFB)

### Notes on the sheet
- Project:
- Title:
- Sheet number:
- Revision:
- Designer:
- out of
- Date:

### Library data of the parts
D2 = CMP-001-M81-1: 1206 RGB LED Wurth
U6 = CMP-001-0000-1: FPGA Titan 61HSIO 3PLL 100BGA; PartId: 1

## Sheet Power.SchDoc
size A3; SheetNumber: 5; SheetTotal: 10
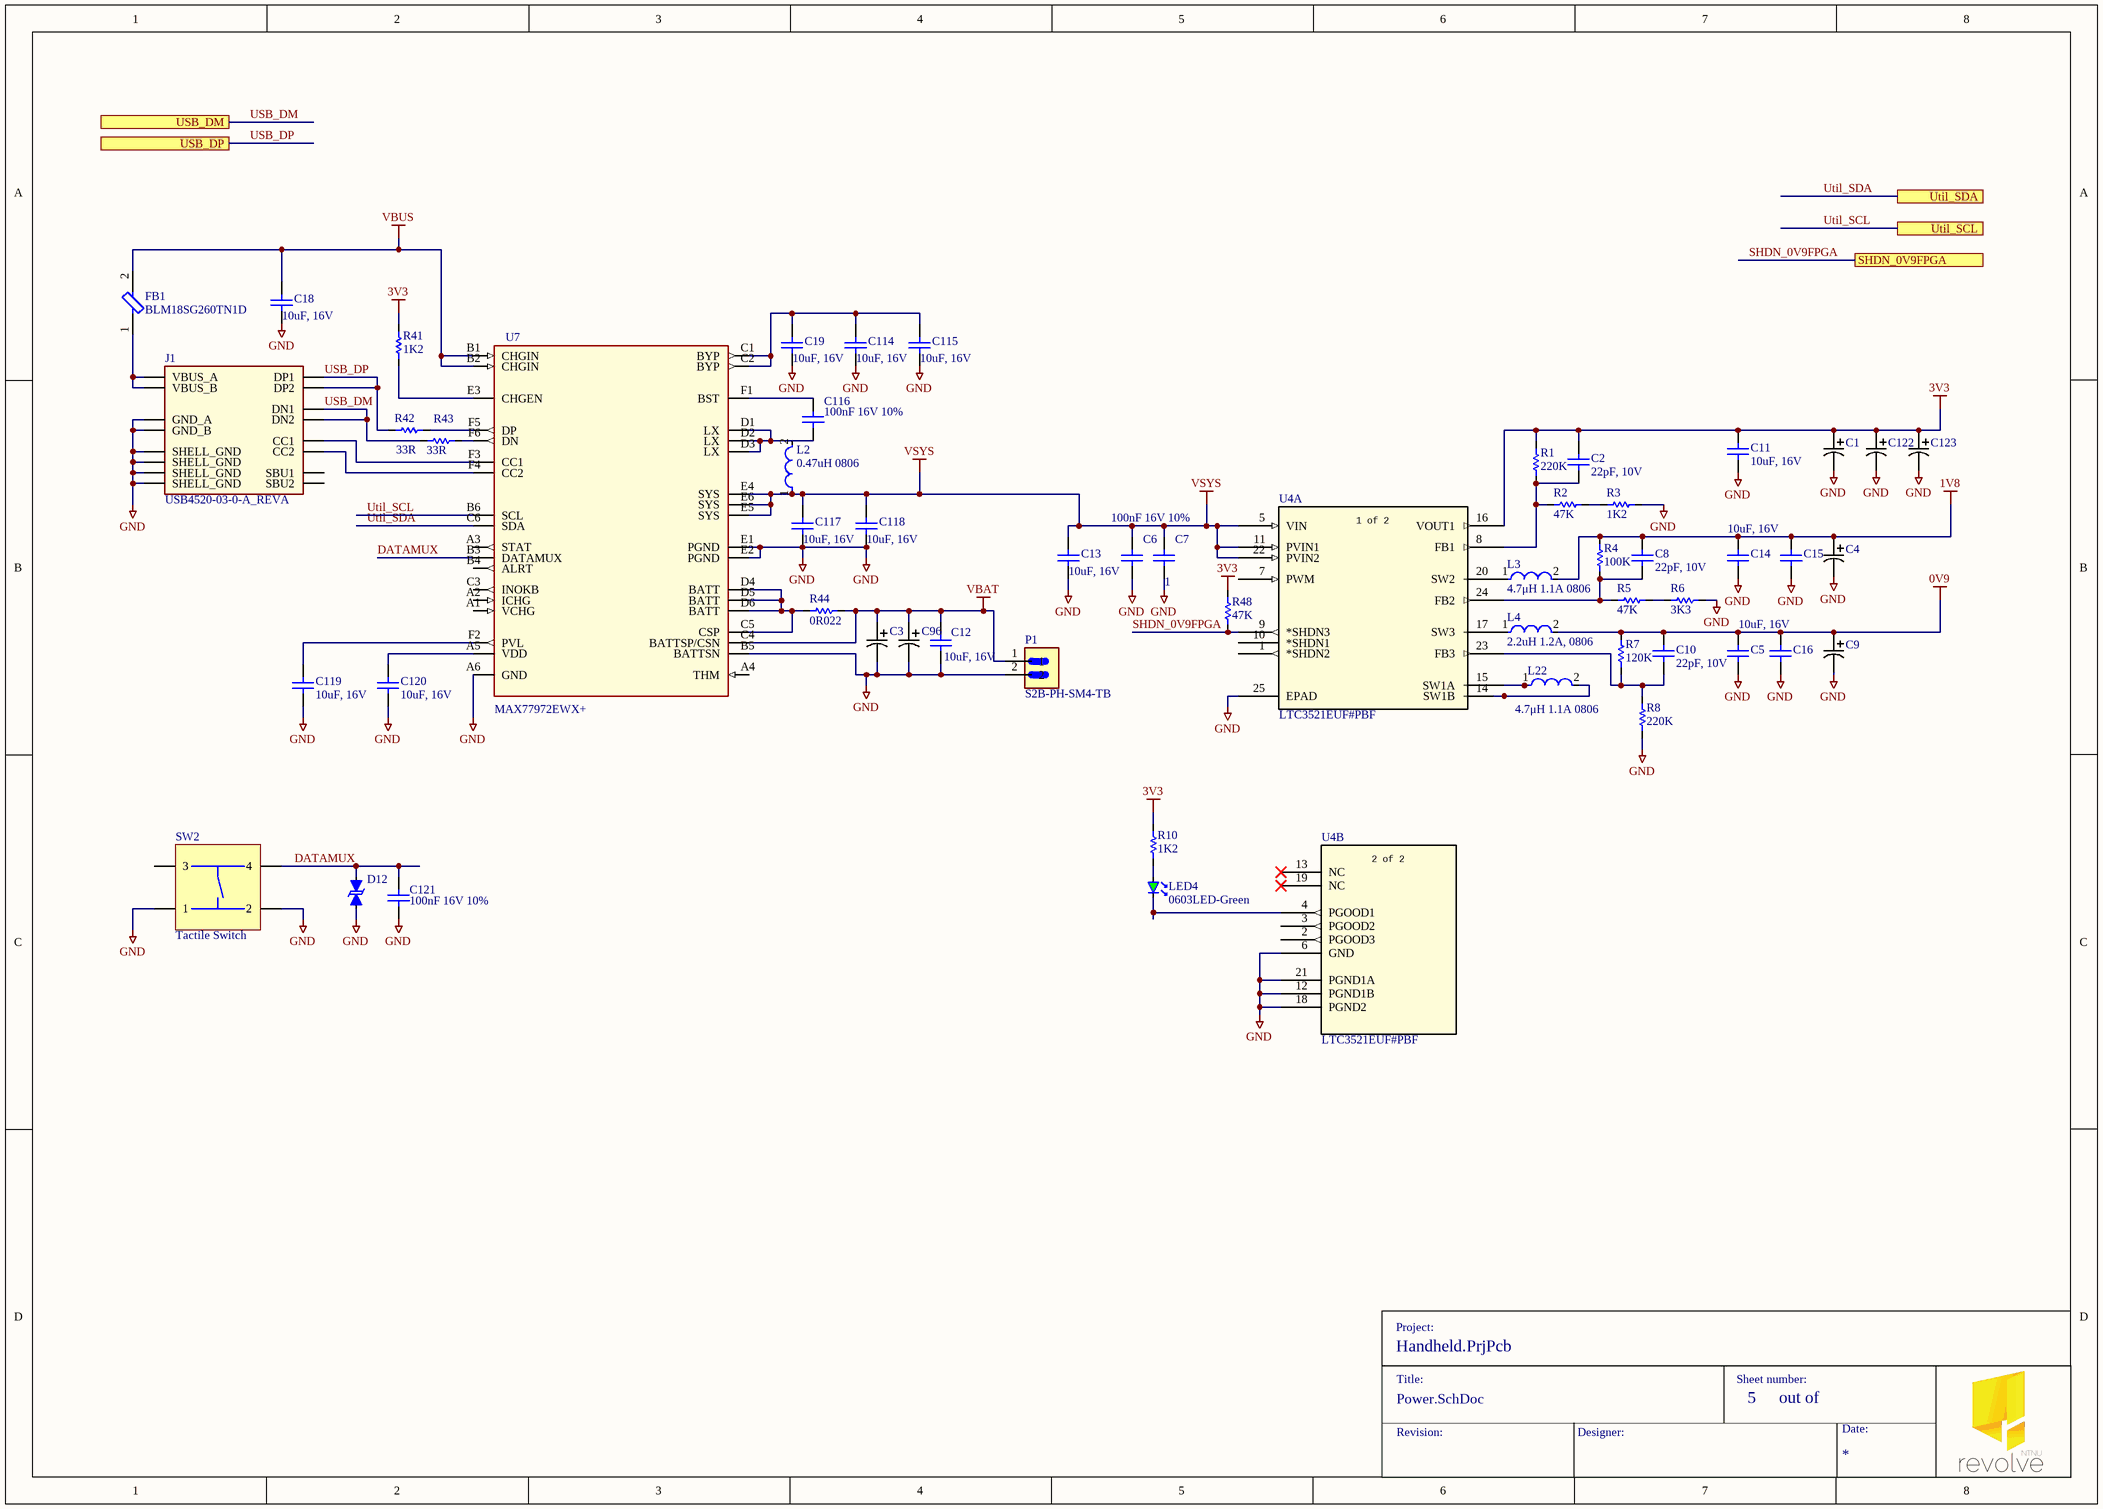
[diagram p4: Power.SchDoc]

### Parts
C1  T529P476M006AAE150  [CAPMP2.1X1.25_1N_KEM]  (value not drawn)
C2  22pF, 10V  [0603 Capacitor]
C3  T529P476M006AAE150  [CAPMP2.1X1.25_1N_KEM]  (value not drawn)
C4  T529P476M006AAE150  [CAPMP2.1X1.25_1N_KEM]  (value not drawn)
C5  10uF, 16V  [0603 Capacitor]
C6  100nF 16V 10%  [0402]
C7  1  [0402]
C8  22pF, 10V  [0603 Capacitor]
C9  T529P476M006AAE150  [CAPMP2.1X1.25_1N_KEM]  (value not drawn)
C10  22pF, 10V  [0603 Capacitor]
C11  10uF, 16V  [0603 Capacitor]
C12  10uF, 16V  [0603 Capacitor]
C13  10uF, 16V  [0603 Capacitor]
C14  10uF, 16V  [0603 Capacitor]
C15  10uF, 16V  [0603 Capacitor]  (value not drawn)
C16  10uF, 16V  [0603 Capacitor]  (value not drawn)
C18  10uF, 16V  [0603 Capacitor]
C19  10uF, 16V  [0603 Capacitor]
C96  T529P476M006AAE150  [CAPMP2.1X1.25_1N_KEM]  (value not drawn)
C114  10uF, 16V  [0603 Capacitor]
C115  10uF, 16V  [0603 Capacitor]
C116  100nF 16V 10%  [0402]
C117  10uF, 16V  [0603 Capacitor]
C118  10uF, 16V  [0603 Capacitor]
C119  10uF, 16V  [0603 Capacitor]
C120  10uF, 16V  [0603 Capacitor]
C121  100nF 16V 10%  [0402]
C122  T529P476M006AAE150  [CAPMP2.1X1.25_1N_KEM]  (value not drawn)
C123  T529P476M006AAE150  [CAPMP2.1X1.25_1N_KEM]  (value not drawn)
D12  DESD3V3E1BL-7B  [CR_X1-DFN1006-2_DIO-M]  (value not drawn)
FB1  BLM18SG260TN1D  [FP-BLM18-0_15-t0_5-d3_3-IPC_B]
J1  USB4520-03-0-A_REVA  [GCT_USB4520-03-0-A_REVA]
L2  0.47uH 0806  [FP-LQM2MPN_G0-IPC_B]
L3  4.7μH 1.1A 0806  [FP-LQM2MPN_G0-IPC_B]
L4  2.2uH 1.2A, 0806  [FP-LQM2MPN_G0-IPC_B]
L22  4.7μH 1.1A 0806  [FP-LQM2MPN_G0-IPC_B]
LED4  0603LED-Green  [LED-0603-RED]
P1  S2B-PH-SM4-TB  [JST_S2B-PH-SM4-TB]
R1  220K  [0603 Resistor]
R2  47K  [0603 Resistor]
R3  1K2  [0603 Resistor]
R4  100K  [0603 Resistor]
R5  47K  [0603 Resistor]
R6  3K3  [0603 Resistor]
R7  120K  [0603 Resistor]
R8  220K  [0603 Resistor]
R10  1K2  [0603 Resistor]
R41  1K2  [0603 Resistor]
R42  33R  [0603 Resistor]
R43  33R  [0603 Resistor]
R44  0R022  [1206 Resistor Package]
R48  47K  [0603 Resistor]
SW2  Tactile Switch  [TE connectivity part no. 2-1437565-8]
U4  LTC3521EUF#PBF  [QFN-24_UF_LIT-M]  (parts A,B of 2)
U7  MAX77972EWX+  [21-100517_W363B3+1_ADI]

### Ports
SHDN_0V9FPGA, USB_DM, USB_DP, Util_SCL, Util_SDA

### Nets
0V9: C5.2 C9.1 C10.2 C16.2 L4.2 R7.2
1V8: C4.1 C8.2 C14.2 C15.2 L3.2 R4.2
3V3: C1.1 C2.2 C11.2 C122.1 C123.1 R1.2 R10.2 R41.2 R48.2 U4.16(VOUT1)
GND: C1.2 C3.2 C4.2 C5.1 C6.1 C7.1 C9.2 C11.1 C12.1 C13.1 C14.1 C15.1 C16.1 C18.1 C19.1 C96.2 C114.1 C115.1 C117.1 C118.1 C119.1 C120.1 C121.1 C122.2 C123.2 D12.2(ANODE) J1.A1_B12(GND_A) J1.B1_A12(GND_B) J1.S1(SHELL_GND) J1.S2(SHELL_GND) J1.S3(SHELL_GND) J1.S4(SHELL_GND) P1.2 R3.2 R6.2 R8.1 SW2.1 SW2.2 U4.6(GND) U4.12(PGND1B) U4.18(PGND2) U4.21(PGND1A) U4.25(EPAD) U7.A6(GND) U7.B5(BATTSN) U7.E1(PGND) U7.E2(PGND)
VBAT: C3.1 C12.2 C96.1 P1.1 R44.2 U7.C4(BATTSP/CSN)
VBUS: C18.2 FB1.2 U7.B1(CHGIN) U7.B2(CHGIN)
VSYS: C6.2 C7.2 C13.2 C117.2 C118.2 L2.1 U4.5(VIN) U4.11(PVIN1) U4.22(PVIN2) U7.E4(SYS) U7.E5(SYS) U7.E6(SYS)
DATAMUX: C121.2 D12.1(CATHODE) SW2.4 U7.B3(DATAMUX)
SHDN_0V9FPGA: R48.1 U4.9(*SHDN3) ; port SHDN_0V9FPGA
USB_DM: J1.A7(DN1) J1.B7(DN2) R43.1 ; port USB_DM
USB_DP: J1.A6(DP1) J1.B6(DP2) R42.1 ; port USB_DP
Util_SCL: U7.B6(SCL) ; port Util_SCL
Util_SDA: U7.C6(SDA) ; port Util_SDA
NetC2_1: C2.1 R1.1 R2.2 U4.8(FB1)
NetC8_1: C8.1 R4.1 R5.1 U4.24(FB2)
NetC10_1: C10.1 R7.1 R8.2 U4.23(FB3)
NetC19_2: C19.2 C114.2 C115.2 U7.C1(BYP) U7.C2(BYP)
NetC116_1: C116.1 U7.D1(LX) U7.D2(LX) U7.D3(LX)
NetC116_2: C116.2 U7.F1(BST)
NetC119_2: C119.2 U7.F2(PVL)
NetC120_2: C120.2 U7.A5(VDD)
NetFB1_1: FB1.1 J1.A4_B9(VBUS_A) J1.B4_A9(VBUS_B)
NetJ1_A5: J1.A5(CC1) U7.F3(CC1)
NetJ1_B5: J1.B5(CC2) U7.F4(CC2)
NetL3_1: L3.1 U4.20(SW2)
NetL4_1: L4.1 U4.17(SW3)
NetL22_1: L22.1 U4.15(SW1A)
NetLED4_1: LED4.1(A) R10.1
NetLED4_2: LED4.2(K) U4.4(PGOOD1)
NetR2_1: R2.1 R3.1
NetR5_2: R5.2 R6.1
NetR41_1: R41.1 U7.E3(CHGEN)
NetR42_2: R42.2 U7.F5(DP)
NetR43_2: R43.2 U7.F6(DN)
NetR44_1: R44.1 U7.C5(CSP) U7.D4(BATT) U7.D5(BATT) U7.D6(BATT)

Not connected (* = marked no-connect by the designer): J1 A8(SBU1) B8(SBU2); L2 2; L22 2; SW2 3; U4 1(*SHDN2) 2(PGOOD3) 3(PGOOD2) 7(PWM) 10(*SHDN1) 13(NC)* 14(SW1B) 19(NC)*; U7 A1(VCHG) A2(ICHG) A3(STAT) A4(THM) B4(ALRT) C3(INOKB)

### Notes on the sheet
- Project:
- Title:
- Sheet number:
- Revision:
- Designer:
- out of
- Date:
- (in symbol LTC3521EUFPBF, part A) 1 of 2
- (in symbol LTC3521EUFPBF, part B) 2 of 2

### Library data of the parts
C1 C3 C4 C9 C96 C122 C123 = CAP-47uF-6.3V 0805: T529, Tantalum, Polymer Tantalum, Reduced Volume, 47 uF, 20%, 6.3 VDC, SMD, Polymer, Substrate, 150 mOhms, 2012, Height Max = 1mm; Manufacturer_Name: Kemet; Copyright: Copyright (C) 2025 Ultra Librarian. All rights reserved.; Manufacturer_Part_Number: T529P476M006AAE150; Datasheet: https://content.kemet.com/datasheets/KEM_T2076_T52X-530.pdf
C2 C8 C10 = CMP-001-C31-8: 22pF, 10V, 1%, NP0, 0603
C5 C11-C16 C18 C19 C114 C115 C117-C120 = CMP-001-B36-7: 10uF, 16V, 20%, X5R, 0603; value: 10uF
C6 C7 C116 C121 = CMP-00017-A.2: 100nF 16V
D12 = DESD3V3E1BL-7B: as D3 on sheet MCU; Copyright: Copyright (C) 2025 Ultra Librarian. All rights reserved.; Manufacturer_Part_Number: DESD3V3E1BL-7B; RefDes: RefDes; Type: Type
FB1 = CMP-001-N50.0.3: Ferrite Bead, 26 Ohm @ 100 MHz, 6A, 7mOhm; Min Frequency: 100MHz; Output Impedance: 26R; Filter Type: FERRITE CHIP; DC Resistance-Max: 7mR; Number of Functions: 1; Packaging: Tape and Reel; JESD-609 Code: e3; Min Operating Temperature: -55°C; Mount: Surface Mount; Case Code: 0603; Material: Ferrite; RoHS Compliant: Yes; Current Rating: 6A; Max Operating Temperature: 125°C; Terminal Finish: Tin; Construction: Chip Bead; Length: 1.6mm; Max Frequency: 100MHz; Height: 0.5mm; REACH SVHC: Yes; Width: 0.8mm
J1 = USB-C: USB Type C Receptacle for USB 2.0, SMT Type Mid Mount, 2.0mm Offset; MF: Global Connector Technology; Design Item ID: USB4520-03-0-A_REVA; Check_prices: https://www.snapeda.com/parts/USB4520-03-0-A/Global+Connector+Technology/view-part/?ref=eda; Value: *; Availability: In Stock; Source: USB4520-03-0-A_REVA.SchLib; Pin Count: 16; SnapEDA_Link: https://www.snapeda.com/parts/USB4520-03-0-A/Global+Connector+Technology/view-part/?ref=snap; Purchase-URL: https://pricing.snapeda.com/search/part/USB4520-03-0-A/?ref=eda; MP: USB4520-03-0-A; Package: None; Price: None; Component Type: Standard; Supplier 1: DigiKey; Supplier Part Number 1: 2073-USB4520-03-0-ACT-ND
L2 = Inductor SMD 0.47uH: Multilayer Type Inductor for Power Lines, 0806 (2016), 0.47μH, 30%, 0.022Ω, 4.8A, CIGT201610EHR47MNE; DC Resistance (DCR): 175mR; Max DC Current: 1.1A; Self Resonant Frequency: 20MHz; Inductance: 4.7uH; Test Frequency: 1MHz; Core Material: Ferrite; Shielding: Shielded; Case Code (Metric): 2016; Min Operating Temperature: -40°C; Width: 1.6mm; Depth: 1.6mm; Inductance Tolerance: 30%; Max Operating Temperature: 125°C; Length: 2mm; Case Code (Imperial): 0806; Case/Package: 0806; Tolerance: 30%; Military Standard: Not; Current Rating: 1.1A; Packaging: Tape and Reel; Package Quantity: 1; Lead Free: Lead Free; Termination: SMD/SMT; Height - Seated (Max): 0.039inch; REACH SVHC: No SVHC; Mount: Surface Mount; DC Current: 1.1A; Height: 0.9mm; Supplier 1: DigiKey; Supplier Part Number 1: 1276-6902-1-ND
L3 L22 = Inductor SMD 4.7uH 1.1A: Multilayer Type Inductor for Power Lines, 0806 (2016), 4.7μH, 30%, 0.175Ω, 1.1A, LQM2MPN4R7NG0L; DC Resistance (DCR): 175mR; Self Resonant Frequency: 20MHz; Inductance: 4.7uH; Test Frequency: 1MHz; Core Material: Ferrite; Shielding: Shielded; Case Code (Metric): 2016; Min Operating Temperature: -40°C; Width: 1.6mm; Depth: 1.6mm; Max DC Current: 1.1A; Inductance Tolerance: 30%; Max Operating Temperature: 125°C; Length: 2mm; Case Code (Imperial): 0806; Case/Package: 0806; Tolerance: 30%; Military Standard: Not; Current Rating: 1.1A; Packaging: Tape and Reel; Package Quantity: 1; Lead Free: Lead Free; Termination: SMD/SMT; Height - Seated (Max): 0.039inch; REACH SVHC: No SVHC; Mount: Surface Mount; DC Current: 1.1A; Height: 0.9mm; Supplier 1: Newark; Supplier Part Number 1: LQM2MPN4R7NG0L
L4 = Inductor SMD 2.2uH 1.2A: Multilayer Type Inductor for Power Lines, 0806 (2016), 4.7μH, 30%, 0.175Ω, 1.1A, LQM2MPN2R2NG0L; DC Resistance (DCR): 175mR; Self Resonant Frequency: 20MHz; Inductance: 4.7uH; Test Frequency: 1MHz; Core Material: Ferrite; Shielding: Shielded; Case Code (Metric): 2016; Min Operating Temperature: -40°C; Width: 1.6mm; Depth: 1.6mm; Max DC Current: 1.1A; Inductance Tolerance: 30%; Max Operating Temperature: 125°C; Length: 2mm; Case Code (Imperial): 0806; Case/Package: 0806; Tolerance: 30%; Military Standard: Not; Current Rating: 1.1A; Packaging: Tape and Reel; Package Quantity: 1; Lead Free: Lead Free; Termination: SMD/SMT; Height - Seated (Max): 0.039inch; REACH SVHC: No SVHC; Mount: Surface Mount; DC Current: 1.1A; Height: 0.9mm; Supplier 1: Avnet; Supplier Part Number 1: LQM2MPN2R2NG0L
LED4 = CMP-001-C10-9: SMD LED 0603, Green
P1 = CMP-005-000000-1: Connector Header Surface Mount, Right Angle 2 position 0.079 (2.00mm); MF: JST Sales; SnapEDA_Link: https://www.snapeda.com/parts/S2B-PH-SM4-TB/JST/view-part/?ref=snap; Package: None; Source: Handheld.SchLib; Value: *; Design Item ID: S2B-PH-SM4-TB; MP: S2B-PH-SM4-TB; Check_prices: https://www.snapeda.com/parts/S2B-PH-SM4-TB/JST/view-part/?ref=eda
R1 R8 = CMP-001-O90-1: 220K, 1%, 1/10W, 0603
R2 R5 R48 = CMP-001-B87-6: 47K, 1%, 1/10W, 0603
R3 R10 R41 = CMP-001-B03-6: 1K2, 5%, 1/10W, 0603
R4 = CMP-001-B15-7: 100K, 1%, 1/10W, 0603; Manufacturer Part Number: ERJ-3EKF1003V; Manufacturer: Panasonic; Resistance: 100kR; Temperature Coefficient: 100ppm/°C; Voltage Rating: 75V; Power Rating: 100mW; Packaging: Tape and Reel; Contact Plating: Tin; Supplier: Digi-Key; Tolerance: 1%; Package Quantity: 1; Length: 1.6mm; Weight: 7.1E-05oz; Number of Terminations: 2; Height: 0.022inch; Case/Package: 0603; Military Standard: Not; Depth: 0.8mm; REACH SVHC: No SVHC; Case Code (Metric): 1608; Min Operating Temperature: -55°C; Features: Automotive AEC-Q200; Max Operating Temperature: 155°C; Mount: Surface Mount; Voltage Rating (DC): 75V; Termination: SMD/SMT; Lead Free: Lead Free; Width: 0.8mm; Composition: Thick Film; Case Code (Imperial): 0603; Supplier Part Number: P100KHTR-ND; Max Power Dissipation: 100mW; Number of Pins: 2; Radiation Hardening: No
R6 = CMP-001-G92-A.2: 3K3, 5%, 1/10W, 0603
R7 = CMP-001-G12-A.2: 120K, 0.1%, 1/10W, 0603
R42 R43 = CMP-001-C30-7: as R13 on sheet MCU; REACH SVHC: No SVHC; Resistance: 33R; Composition: Thick Film; Tolerance: 1%; Lead Free: Lead Free; Contact Plating: Tin; Package Quantity: 1; Number of Terminations: 2; Number of Pins: 2; Case Code (Metric): 1608; Width: 0.031inch; Min Operating Temperature: -55°C; Military Standard: Not; Termination: SMD/SMT; Radiation Hardening: No; Case Code (Imperial): 0603; Mount: Surface Mount; Depth: 0.8mm; Max Operating Temperature: 155°C; Voltage Rating (DC): 75V; Features: Automotive AEC-Q200; Power Rating: 100mW; Packaging: Tape and Reel; Supplier Part Number: P33.0HCT-ND; Length: 1.6mm; Supplier: Digi-Key; Height: 0.022inch; Case/Package: 0603
R44 = CMP-001-H36-A.1: 0R022, 2%, 1/2W, 1206
SW2 = CMP-001-E74-6: Tactile Switch, 24V, 50 mA, Pushbutton - N.O, 2-1437565-8
U4 = LTC3521EUFPBF: 1A Buck-Boost DC/DC and Dual 600mA Buck DC/DC Converters; Manufacturer_Name: Analog Devices Inc; Copyright: Copyright (C) 2025 Ultra Librarian. All rights reserved.; Manufacturer_Part_Number: LTC3521EUF#PBF; Datasheet: https://www.analog.com/media/en/technical-documentation/data-sheets/3521fb.pdf; RefDes: RefDes; Type: Type
U7 = MAX77972EWX+: AccuCharge + ModelGauge 1-Cell Fuel Gauge and 3A Charger with Integrated USB Type-C Detection; Manufacturer_Name: Analog Devices Inc; Copyright: Copyright (C) 2025 Ultra Librarian. All rights reserved.; Manufacturer_Part_Number: MAX77972EWX+; RefDes: RefDes; Type: Type

## Sheet DebugUSB.SchDoc
size A3; SheetNumber: 6; SheetTotal: 10
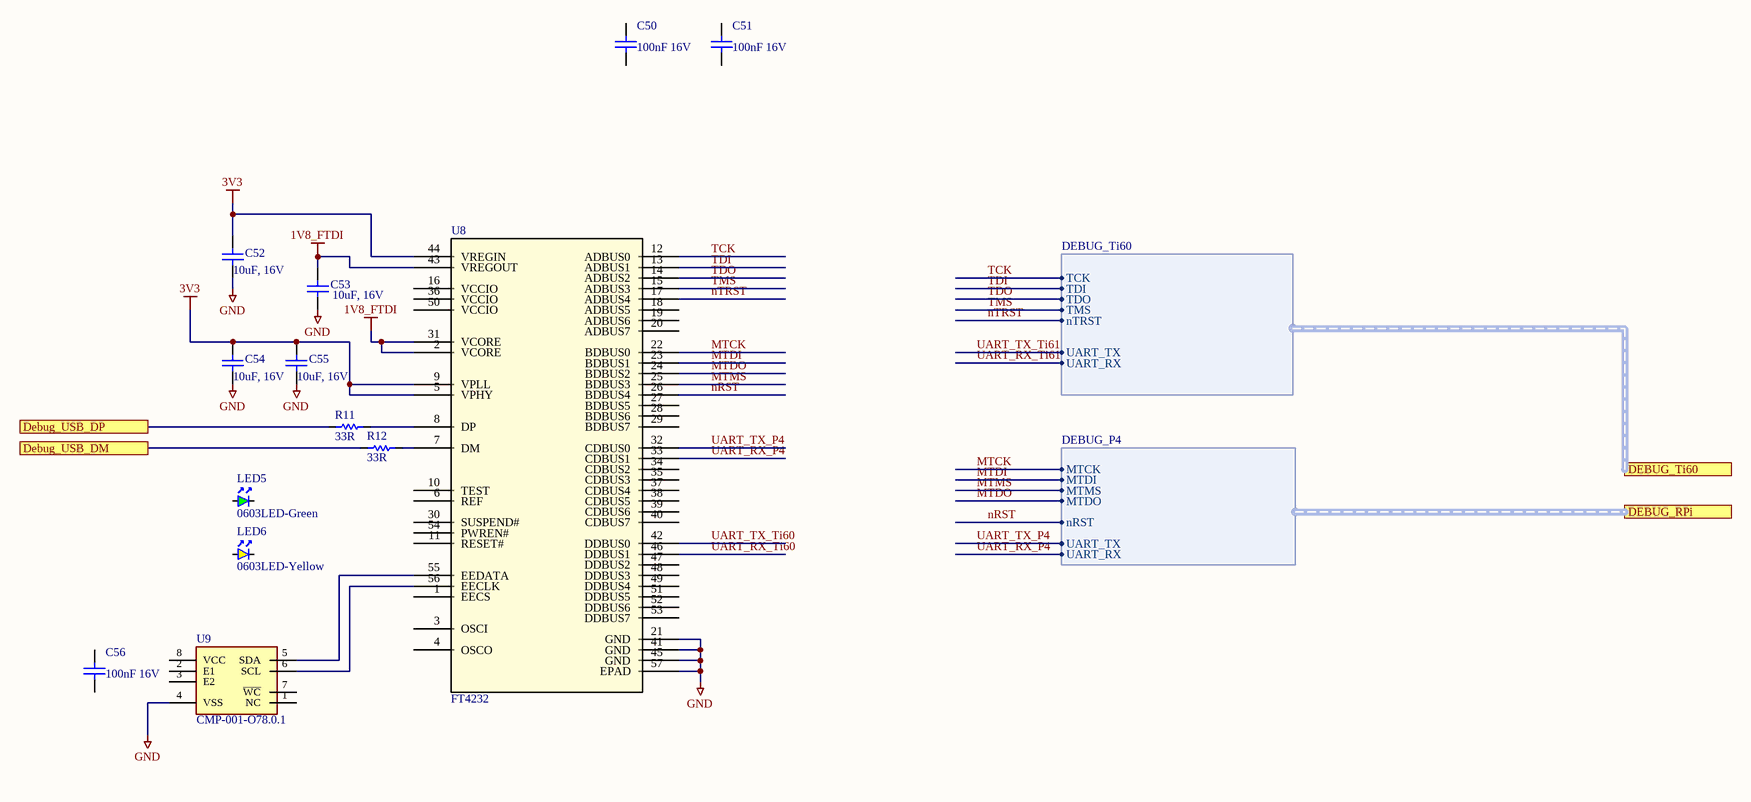
[diagram p5: DebugUSB.SchDoc]

### Parts
C50  100nF 16V  [0402]
C51  100nF 16V  [0402]
C52  10uF, 16V  [0603 Capacitor]
C53  10uF, 16V  [0603 Capacitor]
C54  10uF, 16V  [0603 Capacitor]
C55  10uF, 16V  [0603 Capacitor]
C56  100nF 16V  [0402]
LED5  0603LED-Green  [LED-0603-RED]
LED6  0603LED-Yellow  [LED-0603-RED]
R11  33R  [0603 Resistor]
R12  33R  [0603 Resistor]
U8  FT4232  [VQFN-56Y856_FTD-M]
U9  CMP-001-O78.0.1  [M24C04-DRMN3TP_K-Footprint-1]

### Ports
DEBUG_RPi (harness DEBUG_P4), DEBUG_Ti60 (harness DEBUG_Ti60), Debug_USB_DM, Debug_USB_DP

### Harnesses
DEBUG_Ti60: TCK, TDI, TDO, TMS, nTRST, UART_TX, UART_RX
DEBUG_P4: MTCK, MTDI, nRST, UART_TX, UART_RX, MTMS, MTDO

### Nets
1V8_FTDI: C53.2 U8.2(VCORE) U8.31(VCORE) U8.43(VREGOUT)
3V3: C52.2 C54.2 C55.2 U8.5(VPHY) U8.9(VPLL) U8.44(VREGIN)
GND: C52.1 C53.1 C54.1 C55.1 U8.21(GND) U8.41(GND) U8.45(GND) U8.57(EPAD) U9.4(VSS)
Debug_USB_DM: R12.1 ; port Debug_USB_DM
Debug_USB_DP: R11.1 ; port Debug_USB_DP
MTCK: U8.22(BDBUS0) ; port DEBUG_RPi.MTCK
MTDI: U8.23(BDBUS1) ; port DEBUG_RPi.MTDI
MTDO: U8.24(BDBUS2) ; port DEBUG_RPi.MTDO
MTMS: U8.25(BDBUS3) ; port DEBUG_RPi.MTMS
nRST: U8.26(BDBUS4) ; port DEBUG_RPi.nRST  [project net ESP32_EN]
nTRST: U8.17(ADBUS4) ; port DEBUG_Ti60.nTRST
TCK: U8.12(ADBUS0) ; port DEBUG_Ti60.TCK
TDI: U8.13(ADBUS1) ; port DEBUG_Ti60.TDI
TDO: U8.14(ADBUS2) ; port DEBUG_Ti60.TDO
TMS: U8.15(ADBUS3) ; port DEBUG_Ti60.TMS
UART_RX_P4: U8.33(CDBUS1) ; port DEBUG_RPi.UART_RX
UART_RX_Ti60: U8.46(DDBUS1)
UART_RX_Ti61: port DEBUG_Ti60.UART_RX
UART_TX_P4: U8.32(CDBUS0) ; port DEBUG_RPi.UART_TX
UART_TX_Ti60: U8.42(DDBUS0)
UART_TX_Ti61: port DEBUG_Ti60.UART_TX
NetR11_2: R11.2 U8.8(DP)
NetR12_2: R12.2 U8.7(DM)
NetU8_55: U8.55(EEDATA) U9.5(SDA)
NetU8_56: U8.56(EECLK) U9.6(SCL)

Not connected (* = marked no-connect by the designer): C50 1 2; C51 1 2; C56 1 2; LED5 1(A) 2(K); LED6 1(A) 2(K); U8 1(EECS) 3(OSCI) 4(OSCO) 6(REF) 10(TEST) 11(RESET#) 16(VCCIO) 18(ADBUS5) 19(ADBUS6) 20(ADBUS7) 27(BDBUS5) 28(BDBUS6) 29(BDBUS7) 30(SUSPEND#) 34(CDBUS2) 35(CDBUS3) 36(VCCIO) 37(CDBUS4) 38(CDBUS5) 39(CDBUS6) 40(CDBUS7) 47(DDBUS2) 48(DDBUS3) 49(DDBUS4) 50(VCCIO) 51(DDBUS5) 52(DDBUS6) 53(DDBUS7) 54(PWREN#); U9 1(NC) 2(E1) 3(E2) 7(~{WC}) 8(VCC)

### Notes on the sheet
- Project:
- Title:
- Sheet number:
- Revision:
- Designer:
- out of
- Date:

### Library data of the parts
C50 C51 C56 = CMP-00017-A.2
C52-C55 = CMP-001-B36-7: 10uF, 16V, 20%, X5R, 0603; value: 10uF
LED5 = CMP-001-C10-9: SMD LED 0603, Green
LED6 = CMP-001-I07-1: SMD LED 0603, Yellow
R11 R12 = CMP-001-C30-7: as R13 on sheet MCU; REACH SVHC: No SVHC; Resistance: 33R; Composition: Thick Film; Tolerance: 1%; Lead Free: Lead Free; Contact Plating: Tin; Package Quantity: 1; Number of Terminations: 2; Number of Pins: 2; Case Code (Metric): 1608; Width: 0.031inch; Min Operating Temperature: -55°C; Military Standard: Not; Termination: SMD/SMT; Radiation Hardening: No; Case Code (Imperial): 0603; Mount: Surface Mount; Depth: 0.8mm; Max Operating Temperature: 155°C; Voltage Rating (DC): 75V; Features: Automotive AEC-Q200; Power Rating: 100mW; Packaging: Tape and Reel; Supplier Part Number: P33.0HCT-ND; Length: 1.6mm; Supplier: Digi-Key; Height: 0.022inch; Case/Package: 0603
U8 = CMP-001-0004-2: Usb Hi-speed to Quad Channel Serial UART/JTAG/SPI/I2C IC, QFN-56; Data Rate: 1.5Mbps; Max Supply Voltage: 1.98V; Number of I/Os: 4; Interface: I2C, RS-232, RS-422, RS-485, SPI, UART, USB; Clock Frequency: 12MHz; Min Supply Voltage: 1.62V; Operating Supply Voltage: 1.8V; Width: 8mm; RoHS: Compliant; Length: 8mm; Number of Terminals: 56; Height - Seated (Max): 1mm; Packaging: Cut Tape; REACH SVHC: Yes; Min Operating Temperature: -40°C; Case/Package: VQFN; Terminal Pitch: 500µm; Pins: 64; Lifecycle Status: Production; Max Operating Temperature: 85°C
U9 = CMP-031-000000-1: IC EEPROM 4KBIT I2C 1MHZ 8SOIC; Manufacturer Part Number: M24C04-DRMN3TP/K; Manufacturer: STMicroelectronics; Source: Components - 10.10.25 - 00.26.2.SchLib; Pin Count: 8; Design Item ID: CMP-001-O78.0.1; Component Type: EEPROM

## Sheet Wireless.SchDoc
size A3; SheetNumber: 7; SheetTotal: 10
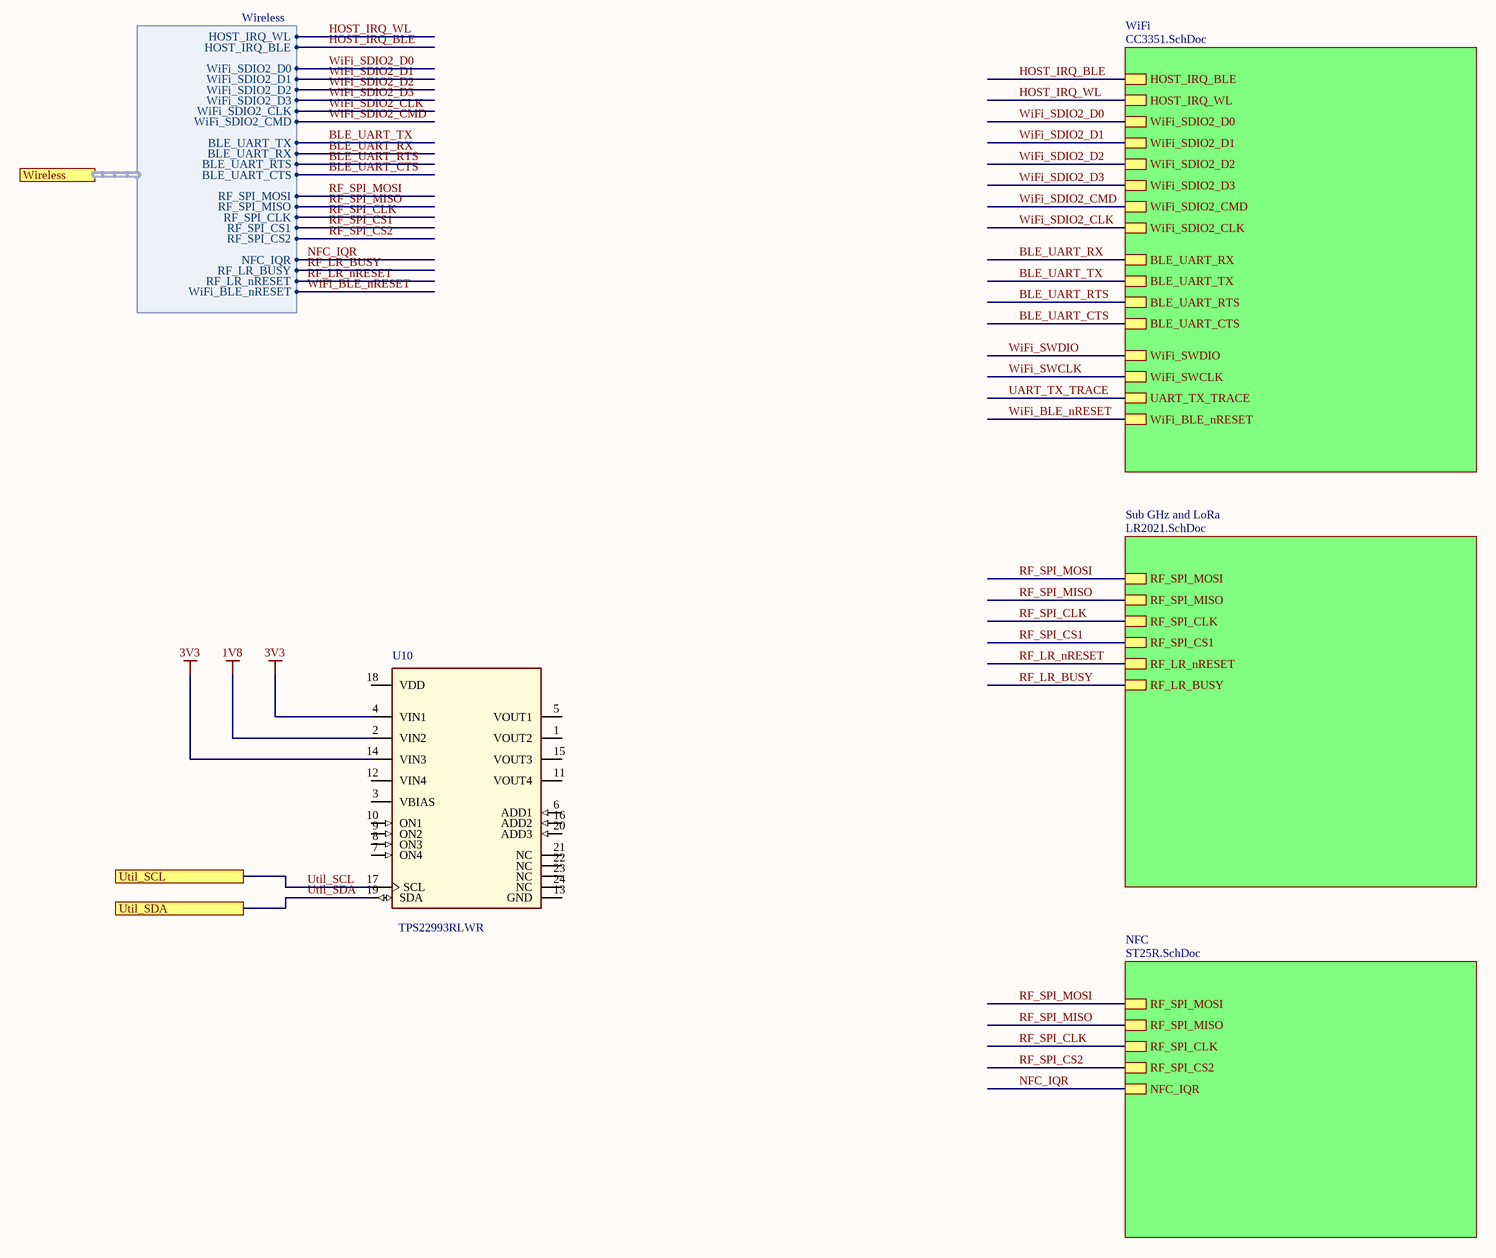
[diagram p6: Wireless.SchDoc]

### Parts
U10  TPS22993RLWR  [FP-RLW0020A-MFG]

### Sub-sheets
NFC = ST25R.SchDoc: RF_SPI_MOSI, RF_SPI_MISO, RF_SPI_CLK, RF_SPI_CS2, NFC_IQR
Sub GHz and LoRa = LR2021.SchDoc: RF_SPI_MOSI, RF_SPI_MISO, RF_SPI_CLK, RF_SPI_CS1, RF_LR_nRESET, RF_LR_BUSY
WiFi = CC3351.SchDoc: HOST_IRQ_BLE, HOST_IRQ_WL, WiFi_SDIO2_D0, WiFi_SDIO2_D1, WiFi_SDIO2_D2, WiFi_SDIO2_D3, WiFi_SDIO2_CMD, WiFi_SDIO2_CLK, BLE_UART_RX, BLE_UART_TX, BLE_UART_RTS, BLE_UART_CTS, WiFi_SWDIO, WiFi_SWCLK, UART_TX_TRACE, WiFi_BLE_nRESET

### Ports
Util_SCL, Util_SDA, Wireless (harness Wireless)

### Harnesses
Wireless: WiFi_SDIO2_D0, WiFi_SDIO2_D1, WiFi_SDIO2_D2, WiFi_SDIO2_D3, WiFi_SDIO2_CLK, WiFi_SDIO2_CMD, BLE_UART_TX, BLE_UART_RX, RF_SPI_MOSI, RF_SPI_CLK, RF_SPI_MISO, RF_SPI_CS1, RF_SPI_CS2, BLE_UART_RTS, BLE_UART_CTS, HOST_IRQ_WL, HOST_IRQ_BLE, NFC_IQR, RF_LR_BUSY, RF_LR_nRESET, WiFi_BLE_nRESET

### Nets
1V8: U10.2(VIN2)
3V3: U10.4(VIN1) U10.14(VIN3)
BLE_UART_CTS: sheet WiFi/BLE_UART_CTS, port Wireless.BLE_UART_CTS
BLE_UART_RTS: sheet WiFi/BLE_UART_RTS, port Wireless.BLE_UART_RTS
BLE_UART_RX: sheet WiFi/BLE_UART_RX, port Wireless.BLE_UART_RX
BLE_UART_TX: sheet WiFi/BLE_UART_TX, port Wireless.BLE_UART_TX
HOST_IRQ_BLE: sheet WiFi/HOST_IRQ_BLE, port Wireless.HOST_IRQ_BLE
HOST_IRQ_WL: sheet WiFi/HOST_IRQ_WL, port Wireless.HOST_IRQ_WL
NFC_IQR: sheet NFC/NFC_IQR, port Wireless.NFC_IQR
RF_LR_BUSY: sheet Sub GHz and LoRa/RF_LR_BUSY, port Wireless.RF_LR_BUSY
RF_LR_nRESET: sheet Sub GHz and LoRa/RF_LR_nRESET, port Wireless.RF_LR_nRESET
RF_SPI_CLK: sheet Sub GHz and LoRa/RF_SPI_CLK, sheet NFC/RF_SPI_CLK, port Wireless.RF_SPI_CLK
RF_SPI_CS1: sheet Sub GHz and LoRa/RF_SPI_CS1, port Wireless.RF_SPI_CS1
RF_SPI_CS2: sheet NFC/RF_SPI_CS2, port Wireless.RF_SPI_CS2
RF_SPI_MISO: sheet Sub GHz and LoRa/RF_SPI_MISO, sheet NFC/RF_SPI_MISO, port Wireless.RF_SPI_MISO
RF_SPI_MOSI: sheet Sub GHz and LoRa/RF_SPI_MOSI, sheet NFC/RF_SPI_MOSI, port Wireless.RF_SPI_MOSI
Util_SCL: U10.17(SCL) ; port Util_SCL
Util_SDA: U10.19(SDA) ; port Util_SDA
WiFi_BLE_nRESET: sheet WiFi/WiFi_BLE_nRESET, port Wireless.WiFi_BLE_nRESET
WiFi_SDIO2_CLK: sheet WiFi/WiFi_SDIO2_CLK, port Wireless.WiFi_SDIO2_CLK
WiFi_SDIO2_CMD: sheet WiFi/WiFi_SDIO2_CMD, port Wireless.WiFi_SDIO2_CMD
WiFi_SDIO2_D0: sheet WiFi/WiFi_SDIO2_D0, port Wireless.WiFi_SDIO2_D0
WiFi_SDIO2_D1: sheet WiFi/WiFi_SDIO2_D1, port Wireless.WiFi_SDIO2_D1
WiFi_SDIO2_D2: sheet WiFi/WiFi_SDIO2_D2, port Wireless.WiFi_SDIO2_D2
WiFi_SDIO2_D3: sheet WiFi/WiFi_SDIO2_D3, port Wireless.WiFi_SDIO2_D3

Not connected (* = marked no-connect by the designer): U10 1(VOUT2) 3(VBIAS) 5(VOUT1) 6(ADD1) 7(ON4) 8(ON3) 9(ON2) 10(ON1) 11(VOUT4) 12(VIN4) 13(GND) 15(VOUT3) 16(ADD2) 18(VDD) 20(ADD3) 21(NC) 22(NC) 23(NC) 24(NC)

### Notes on the sheet
- Project:
- Title:
- Sheet number:
- Revision:
- Designer:
- out of
- Date:

### Library data of the parts
U10 = TPS22993: IC PWR SWITCH N-CHAN 1:1 20WQFN; Number of Outputs: 4; Max Output Current: 1.2A; Interface: I2C; Output Configuration: High Side; Packaging: Tape and Reel; Case/Package: WFQFN; Lead Free: Lead Free; Max Operating Temperature: 85°C; RoHS Compliant: Yes; Number of Channels: 4; Min Operating Temperature: -40°C; Supplier 1: DigiKey; Supplier Part Number 1: 296-51869-1-ND